# EAGLE schematic A10-OLinuXino_Rev_A (EAGLE 5.12)
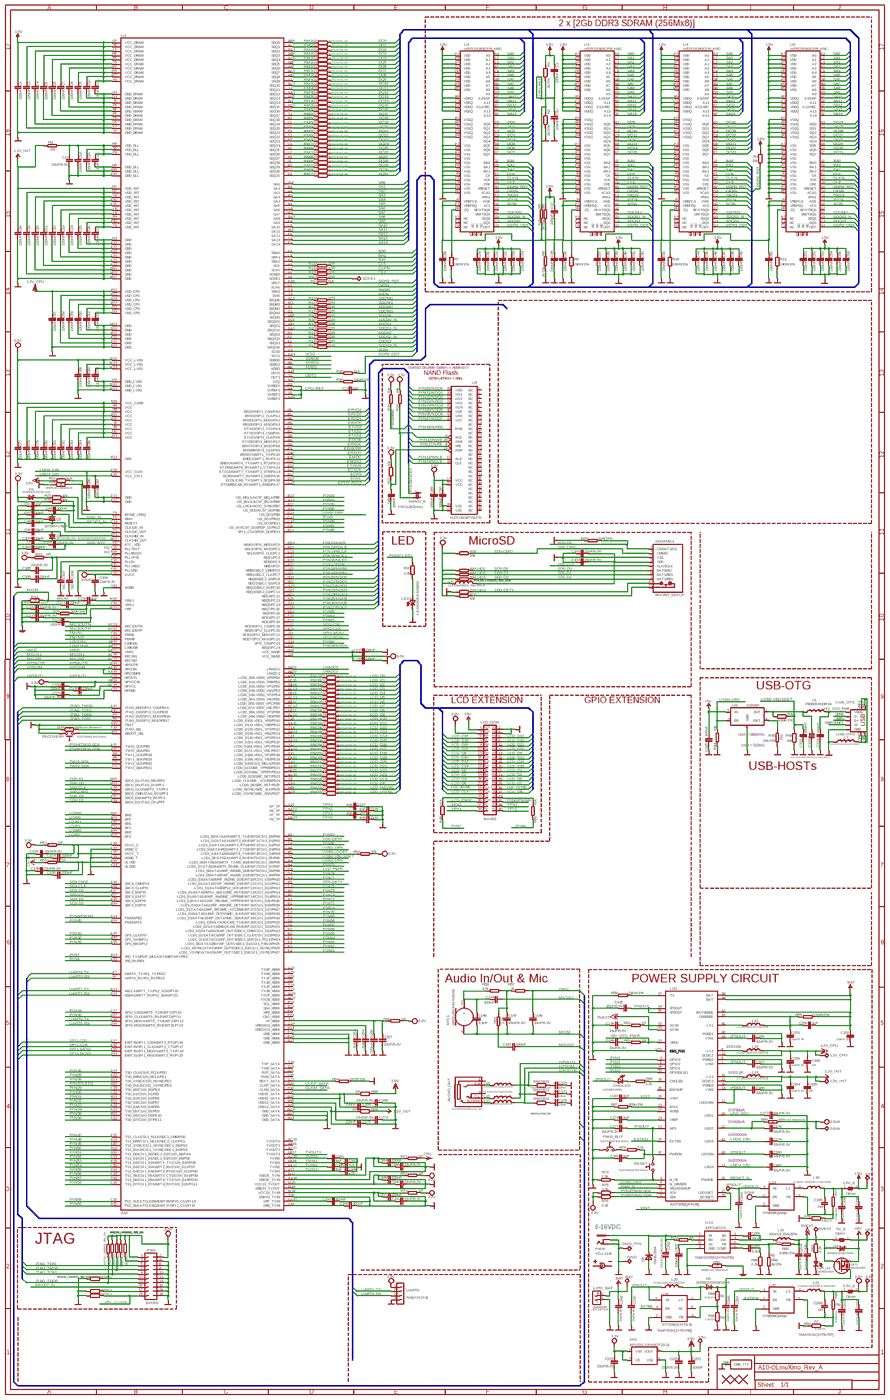
[diagram p0: schematic, sheet 1, overview]
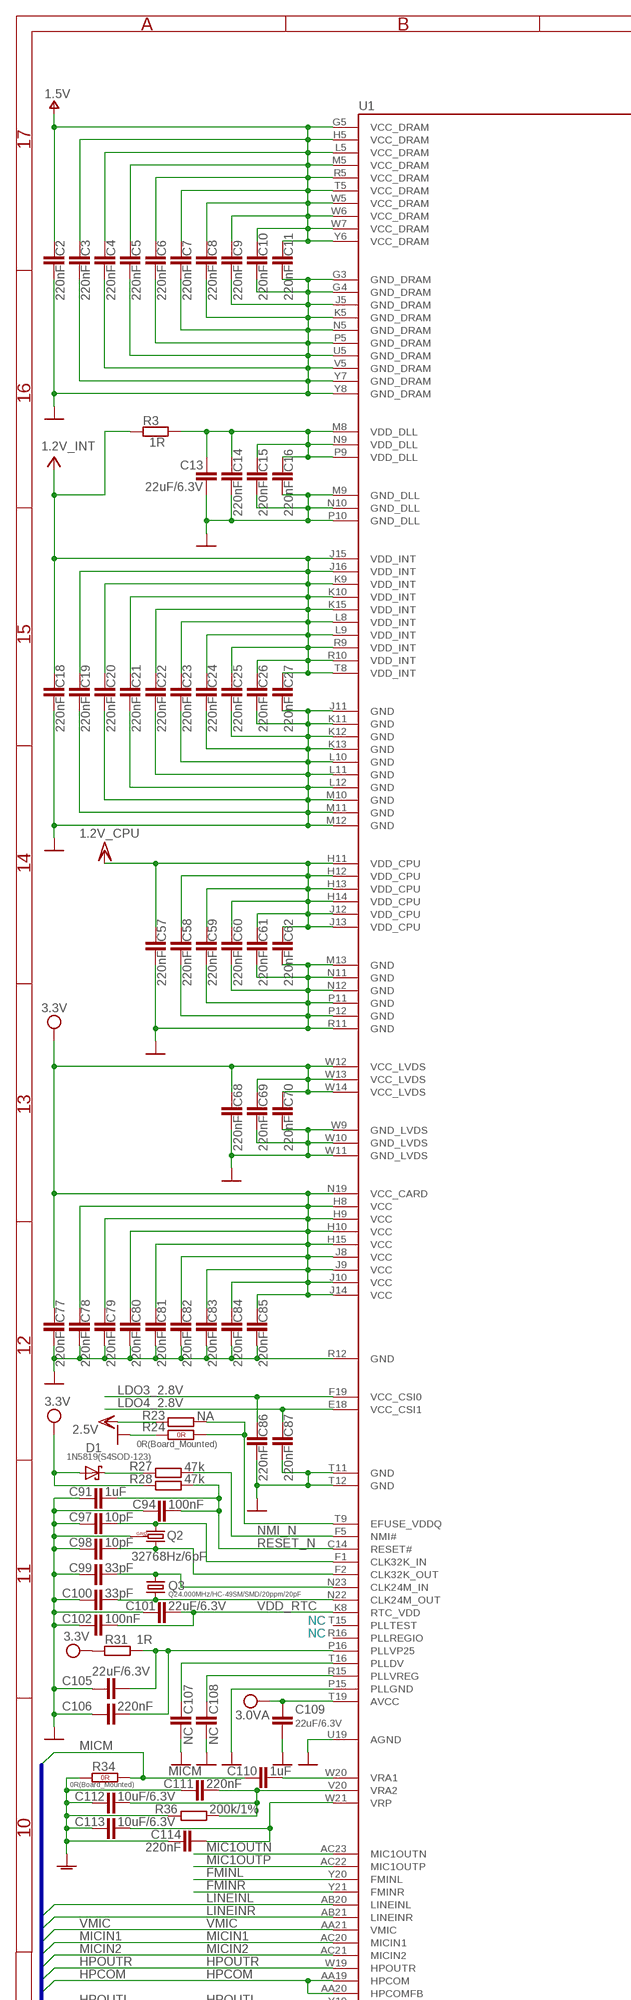
[diagram p1: schematic, sheet 1, part 1 of 4]
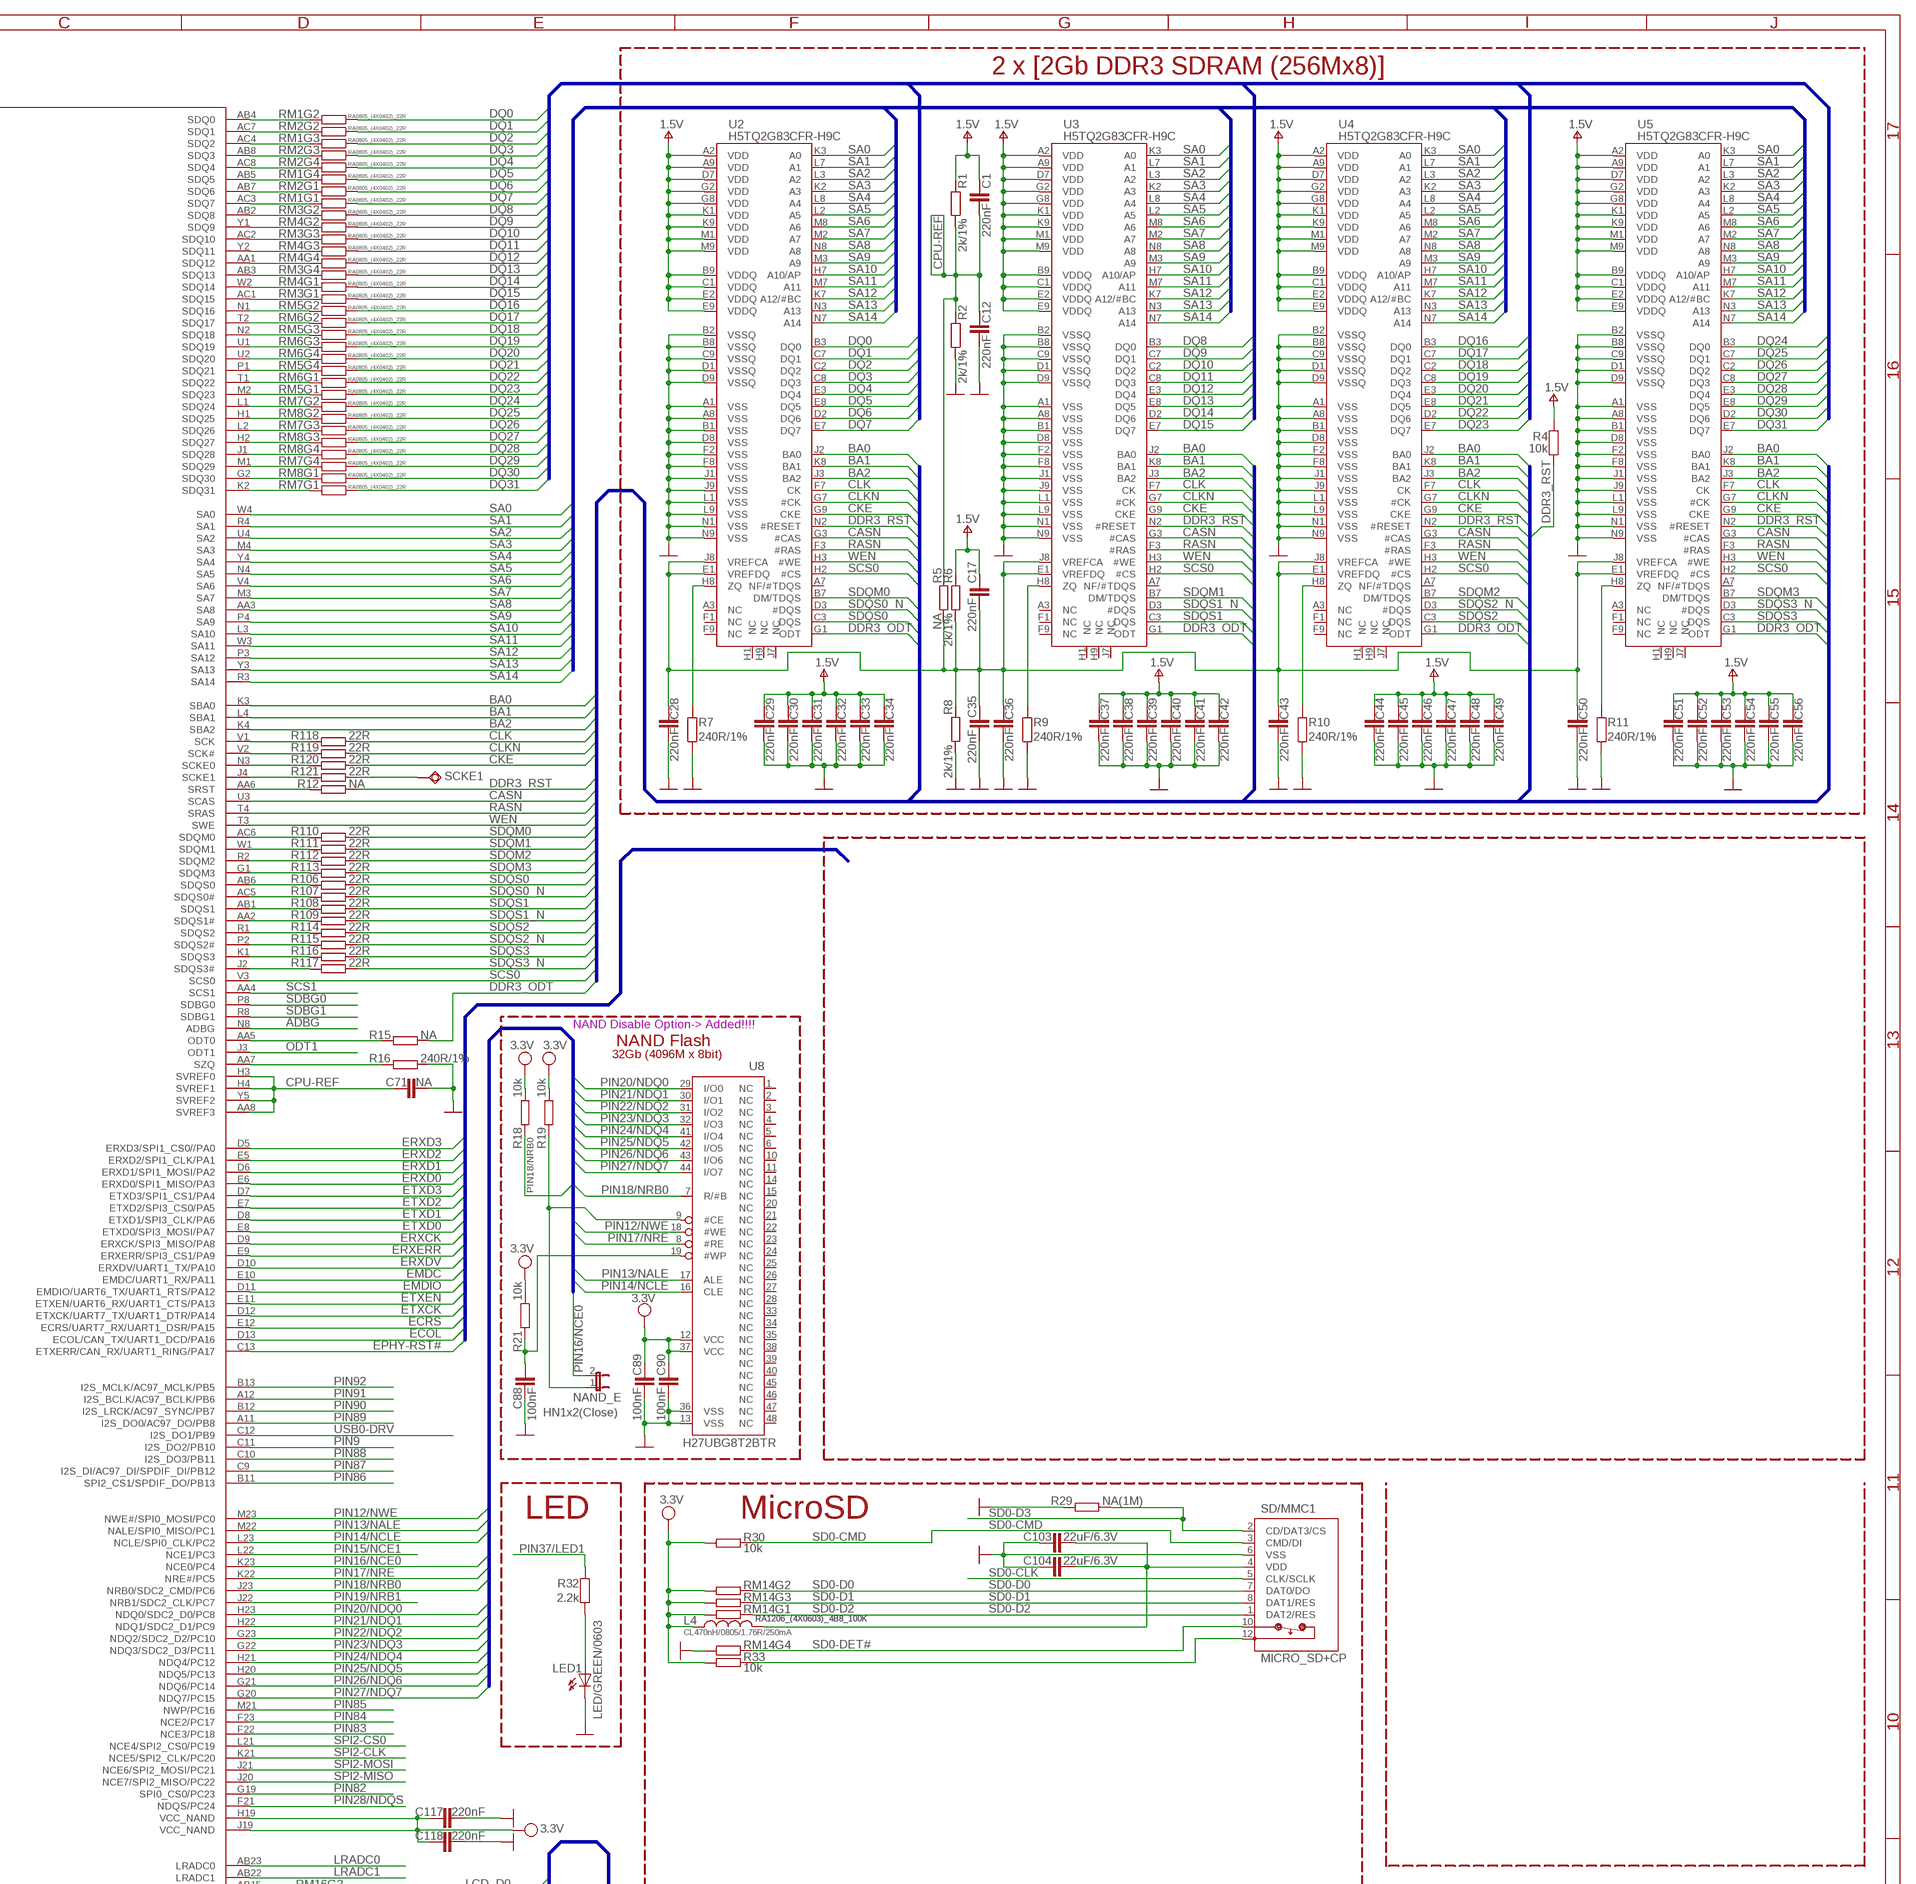
[diagram p2: schematic, sheet 1, part 2 of 4]
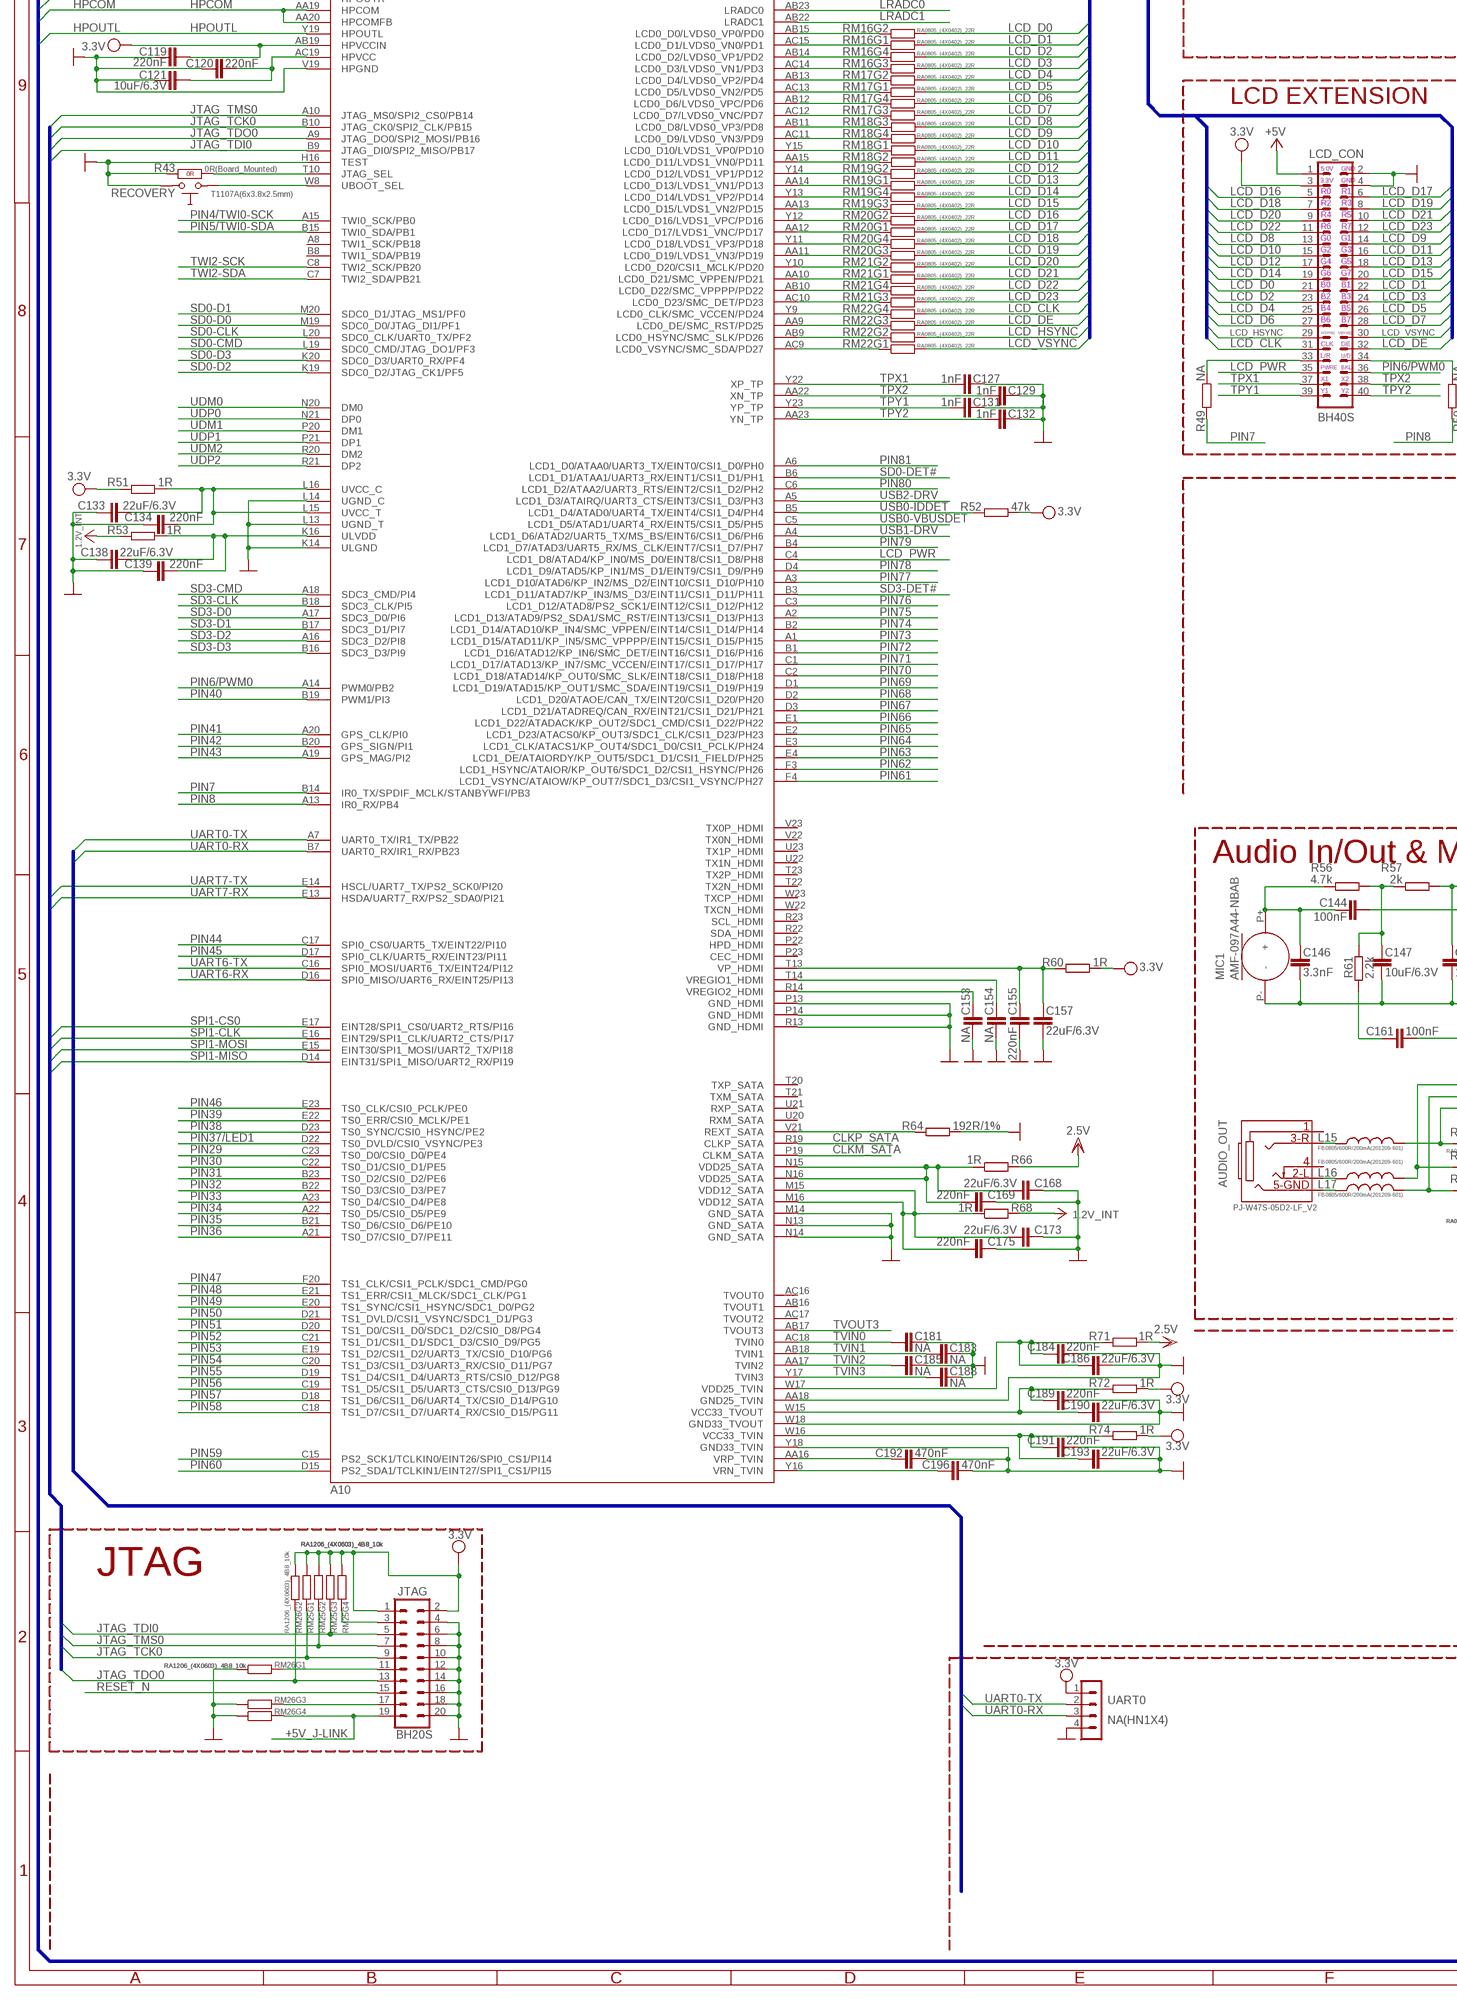
[diagram p3: schematic, sheet 1, part 3 of 4]
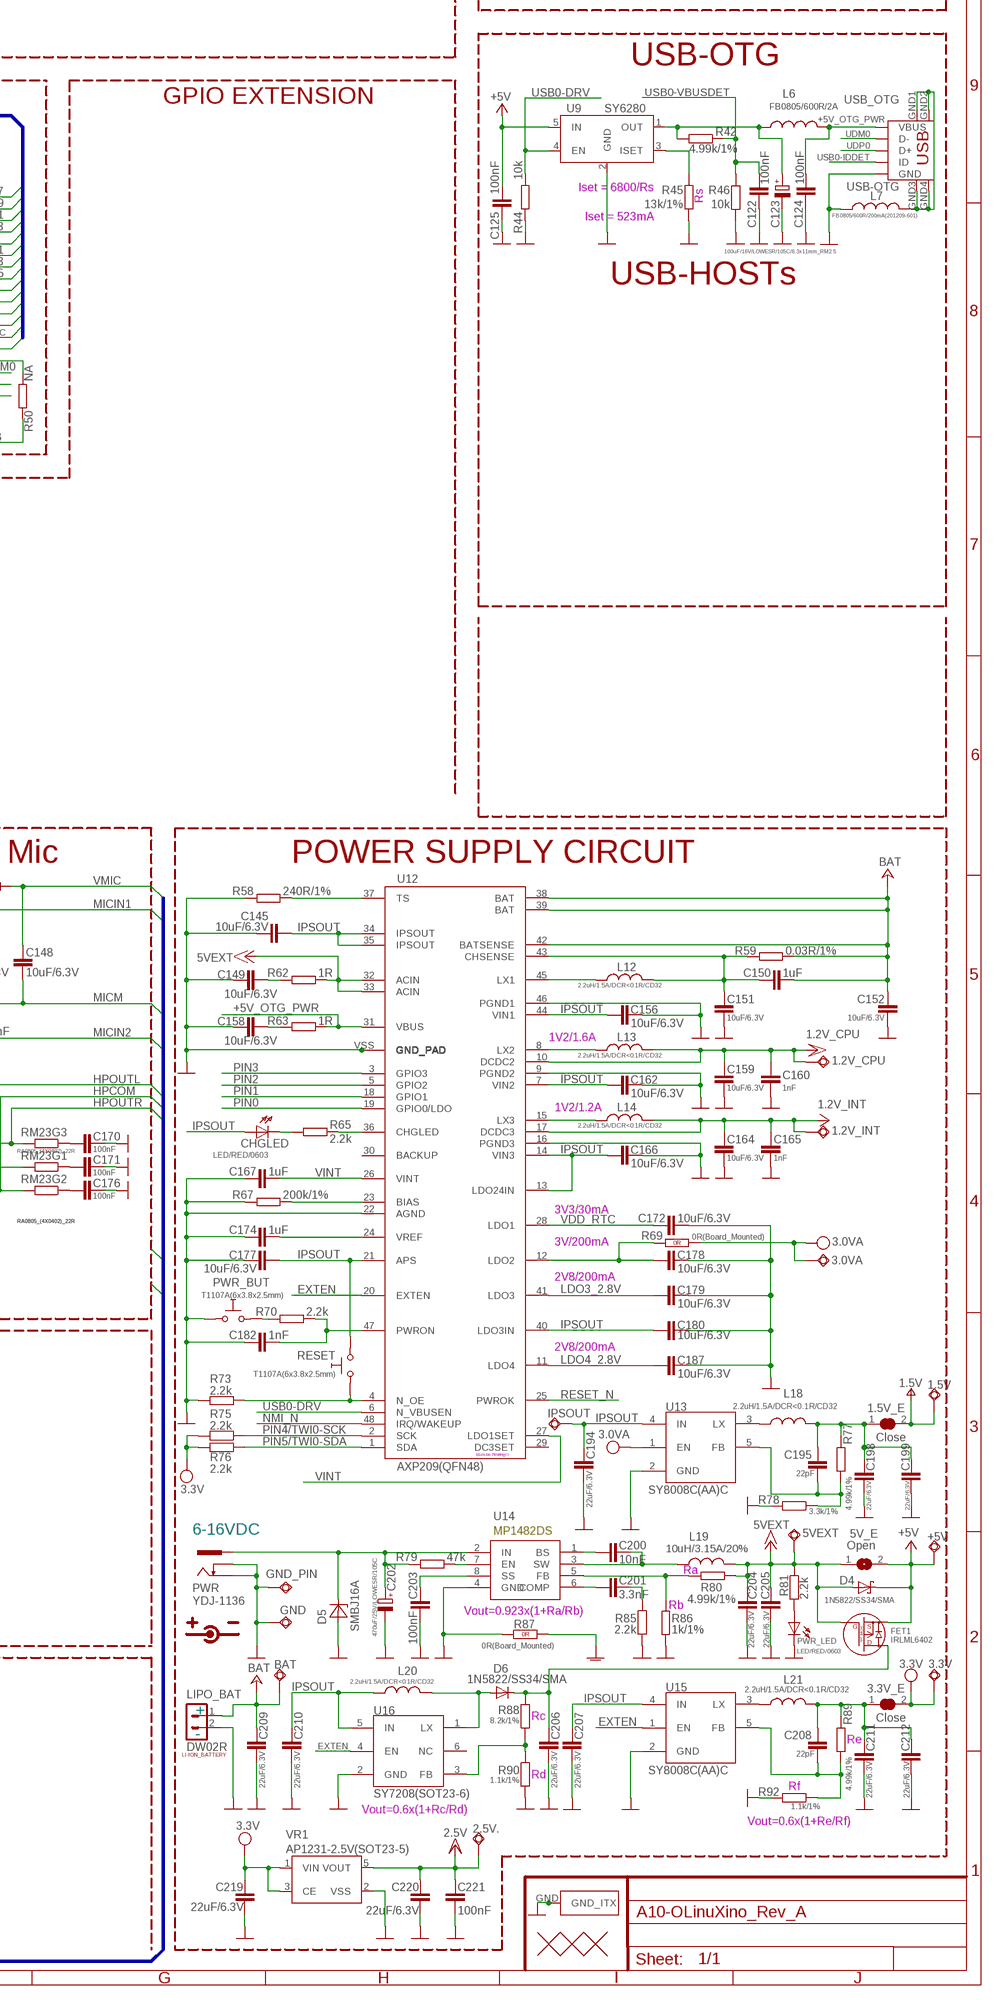
[diagram p4: schematic, sheet 1, part 4 of 4]

## Parts
1.2V_CPU  TESTPADTESTPAD_40-ROUND  [TESTPAD_40-ROUND]
1.2V_INT  TESTPADTESTPAD_40-ROUND  [TESTPAD_40-ROUND]
1.5V  TESTPADTESTPAD_40-ROUND  [TESTPAD_40-ROUND]
1.5V_E  Close  SJSJ_1_SMALLER_CLOSE  [SJ_1_SMALLER_CLOSE]
2.5V.  TESTPADTESTPAD_40-ROUND  [TESTPAD_40-ROUND]
3.0VA  TESTPADTESTPAD_40-ROUND  [TESTPAD_40-ROUND]
3.3V  TESTPADTESTPAD_40-ROUND  [TESTPAD_40-ROUND]
3.3V_E  Close  SJSJ_1_SMALLER_CLOSE  [SJ_1_SMALLER_CLOSE]
5V_E  Open  SJSJ_SMALLER  [SJ_1_SMALLER]
5VEXT  TESTPADTESTPAD_40-ROUND  [TESTPAD_40-ROUND]
+5V  TESTPADTESTPAD_40-ROUND  [TESTPAD_40-ROUND]
AUDIO_OUT  PJ-W47S-05D2-LF_V2  AUDIO_JACK_5PINPJ-W47S-05D2-LF_V2  [PJ-W47S-05D2-LF_5PIN_V2]
BAT  TESTPADTESTPAD_40-ROUND  [TESTPAD_40-ROUND]
C1  220nF  C-EUC0603_DWS  [C0603_DWS]
C2  220nF  C-EUC0603_DWS  [C0603_DWS]
C3  220nF  C-EUC0603_DWS  [C0603_DWS]
C4  220nF  C-EUC0603_DWS  [C0603_DWS]
C5  220nF  C-EUC0603_DWS  [C0603_DWS]
C6  220nF  C-EUC0603_DWS  [C0603_DWS]
C7  220nF  C-EUC0603_DWS  [C0603_DWS]
C8  220nF  C-EUC0603_DWS  [C0603_DWS]
C9  220nF  C-EUC0603_DWS  [C0603_DWS]
C10  220nF  C-EUC0603_DWS  [C0603_DWS]
C11  220nF  C-EUC0603_DWS  [C0603_DWS]
C12  220nF  C-EUC0603_DWS  [C0603_DWS]
C13  22uF/6.3V  C-EUC0603_DWS  [C0603_DWS]
C14  220nF  C-EUC0603_DWS  [C0603_DWS]
C15  220nF  C-EUC0603_DWS  [C0603_DWS]
C16  220nF  C-EUC0603_DWS  [C0603_DWS]
C17  220nF  C-EUC0603_DWS  [C0603_DWS]
C18  220nF  C-EUC0603_DWS  [C0603_DWS]
C19  220nF  C-EUC0603_DWS  [C0603_DWS]
C20  220nF  C-EUC0603_DWS  [C0603_DWS]
C21  220nF  C-EUC0603_DWS  [C0603_DWS]
C22  220nF  C-EUC0603_DWS  [C0603_DWS]
C23  220nF  C-EUC0603_DWS  [C0603_DWS]
C24  220nF  C-EUC0603_DWS  [C0603_DWS]
C25  220nF  C-EUC0603_DWS  [C0603_DWS]
C26  220nF  C-EUC0603_DWS  [C0603_DWS]
C27  220nF  C-EUC0603_DWS  [C0603_DWS]
C28  220nF  C-EUC0603_DWS  [C0603_DWS]
C29  220nF  C-EUC0603_DWS  [C0603_DWS]
C30  220nF  C-EUC0603_DWS  [C0603_DWS]
C31  220nF  C-EUC0603_DWS  [C0603_DWS]
C32  220nF  C-EUC0603_DWS  [C0603_DWS]
C33  220nF  C-EUC0603_DWS  [C0603_DWS]
C34  220nF  C-EUC0603_DWS  [C0603_DWS]
C35  220nF  C-EUC0603_DWS  [C0603_DWS]
C36  220nF  C-EUC0603_DWS  [C0603_DWS]
C37  220nF  C-EUC0603_DWS  [C0603_DWS]
C38  220nF  C-EUC0603_DWS  [C0603_DWS]
C39  220nF  C-EUC0603_DWS  [C0603_DWS]
C40  220nF  C-EUC0603_DWS  [C0603_DWS]
C41  220nF  C-EUC0603_DWS  [C0603_DWS]
C42  220nF  C-EUC0603_DWS  [C0603_DWS]
C43  220nF  C-EUC0603_DWS  [C0603_DWS]
C44  220nF  C-EUC0603_DWS  [C0603_DWS]
C45  220nF  C-EUC0603_DWS  [C0603_DWS]
C46  220nF  C-EUC0603_DWS  [C0603_DWS]
C47  220nF  C-EUC0603_DWS  [C0603_DWS]
C48  220nF  C-EUC0603_DWS  [C0603_DWS]
C49  220nF  C-EUC0603_DWS  [C0603_DWS]
C50  220nF  C-EUC0603_DWS  [C0603_DWS]
C51  220nF  C-EUC0603_DWS  [C0603_DWS]
C52  220nF  C-EUC0603_DWS  [C0603_DWS]
C53  220nF  C-EUC0603_DWS  [C0603_DWS]
C54  220nF  C-EUC0603_DWS  [C0603_DWS]
C55  220nF  C-EUC0603_DWS  [C0603_DWS]
C56  220nF  C-EUC0603_DWS  [C0603_DWS]
C57  220nF  C-EUC0603_DWS  [C0603_DWS]
C58  220nF  C-EUC0603_DWS  [C0603_DWS]
C59  220nF  C-EUC0603_DWS  [C0603_DWS]
C60  220nF  C-EUC0603_DWS  [C0603_DWS]
C61  220nF  C-EUC0603_DWS  [C0603_DWS]
C62  220nF  C-EUC0603_DWS  [C0603_DWS]
C68  220nF  C-EUC0603_DWS  [C0603_DWS]
C69  220nF  C-EUC0603_DWS  [C0603_DWS]
C70  220nF  C-EUC0603_DWS  [C0603_DWS]
C71  NA  C-EUC0603_DWS  [C0603_DWS]
C77  220nF  C-EUC0603_DWS  [C0603_DWS]
C78  220nF  C-EUC0603_DWS  [C0603_DWS]
C79  220nF  C-EUC0603_DWS  [C0603_DWS]
C80  220nF  C-EUC0603_DWS  [C0603_DWS]
C81  220nF  C-EUC0603_DWS  [C0603_DWS]
C82  220nF  C-EUC0603_DWS  [C0603_DWS]
C83  220nF  C-EUC0603_DWS  [C0603_DWS]
C84  220nF  C-EUC0603_DWS  [C0603_DWS]
C85  220nF  C-EUC0603_DWS  [C0603_DWS]
C86  220nF  C-EUC0603_DWS  [C0603_DWS]
C87  220nF  C-EUC0603_DWS  [C0603_DWS]
C88  100nF  C-EUC0603_DWS  [C0603_DWS]
C89  100nF  C-EUC0603_DWS  [C0603_DWS]
C90  100nF  C-EUC0603_DWS  [C0603_DWS]
C91  1uF  C-EUC0603_DWS  [C0603_DWS]
C94  100nF  C-EUC0603_DWS  [C0603_DWS]
C97  10pF  C-EUC0603_DWS  [C0603_DWS]
C98  10pF  C-EUC0603_DWS  [C0603_DWS]
C99  33pF  C-EUC0603_DWS  [C0603_DWS]
C100  33pF  C-EUC0603_DWS  [C0603_DWS]
C101  22uF/6.3V  C-EUC0603_DWS  [C0603_DWS]
C102  100nF  C-EUC0603_DWS  [C0603_DWS]
C103  22uF/6.3V  C-EUC0603_DWS  [C0603_DWS]
C104  22uF/6.3V  C-EUC0603_DWS  [C0603_DWS]
C105  22uF/6.3V  C-EUC0603_DWS  [C0603_DWS]
C106  220nF  C-EUC0603_DWS  [C0603_DWS]
C107  NC  C-EUC0603_DWS  [C0603_DWS]
C108  NC  C-EUC0603_DWS  [C0603_DWS]
C109  22uF/6.3V  C-EUC0603_DWS  [C0603_DWS]
C110  1uF  C-EUC0603_DWS  [C0603_DWS]
C111  220nF  C-EUC0603_DWS  [C0603_DWS]
C112  10uF/6.3V  C-EUC0603_DWS  [C0603_DWS]
C113  10uF/6.3V  C-EUC0603_DWS  [C0603_DWS]
C114  220nF  C-EUC0603_DWS  [C0603_DWS]
C117  220nF  C-EUC0603_DWS  [C0603_DWS]
C118  220nF  C-EUC0603_DWS  [C0603_DWS]
C119  220nF  C-EUC0603_DWS  [C0603_DWS]
C120  220nF  C-EUC0603_DWS  [C0603_DWS]
C121  10uF/6.3V  C-EUC0603_DWS  [C0603_DWS]
C122  100nF  C-EUC0603_DWS  [C0603_DWS]
C123  100uF/16V/LOWESR/105C/6.3x11mm_RM2.5  CPOL-EUE2.5-6.3  [E2,5-6,3]
C124  100nF  C-EUC0603_DWS  [C0603_DWS]
C125  100nF  C-EUC0603_DWS  [C0603_DWS]
C127  1nF  C-EUC0603_DWS  [C0603_DWS]
C129  1nF  C-EUC0603_DWS  [C0603_DWS]
C131  1nF  C-EUC0603_DWS  [C0603_DWS]
C132  1nF  C-EUC0603_DWS  [C0603_DWS]
C133  22uF/6.3V  C-EUC0603_DWS  [C0603_DWS]
C134  220nF  C-EUC0603_DWS  [C0603_DWS]
C138  22uF/6.3V  C-EUC0603_DWS  [C0603_DWS]
C139  220nF  C-EUC0603_DWS  [C0603_DWS]
C144  100nF  C-EUC0603_DWS  [C0603_DWS]
C145  10uF/6.3V  C-EUC0603_DWS  [C0603_DWS]
C146  3.3nF  C-EUC0603_DWS  [C0603_DWS]
C147  10uF/6.3V  C-EUC0603_DWS  [C0603_DWS]
C148  10uF/6.3V  C-EUC0603_DWS  [C0603_DWS]
C149  10uF/6.3V  C-EUC0603_DWS  [C0603_DWS]
C150  1uF  C-EUC0603_DWS  [C0603_DWS]
C151  10uF/6.3V  C-EUC0603_DWS  [C0603_DWS]
C152  10uF/6.3V  C-EUC0603_DWS  [C0603_DWS]
C153  NA  C-EUC0603_DWS  [C0603_DWS]
C154  NA  C-EUC0603_DWS  [C0603_DWS]
C155  220nF  C-EUC0603_DWS  [C0603_DWS]
C156  10uF/6.3V  C-EUC0603_DWS  [C0603_DWS]
C157  22uF/6.3V  C-EUC0603_DWS  [C0603_DWS]
C158  10uF/6.3V  C-EUC0603_DWS  [C0603_DWS]
C159  10uF/6.3V  C-EUC0603_DWS  [C0603_DWS]
C160  1nF  C-EUC0603_DWS  [C0603_DWS]
C161  100nF  C-EUC0603_DWS  [C0603_DWS]
C162  10uF/6.3V  C-EUC0603_DWS  [C0603_DWS]
C164  10uF/6.3V  C-EUC0603_DWS  [C0603_DWS]
C165  1nF  C-EUC0603_DWS  [C0603_DWS]
C166  10uF/6.3V  C-EUC0603_DWS  [C0603_DWS]
C167  1uF  C-EUC0603_DWS  [C0603_DWS]
C168  22uF/6.3V  C-EUC0603_DWS  [C0603_DWS]
C169  220nF  C-EUC0603_DWS  [C0603_DWS]
C170  100nF  C-EUC0603_DWS  [C0603_DWS]
C171  100nF  C-EUC0603_DWS  [C0603_DWS]
C172  10uF/6.3V  C-EUC0603_DWS  [C0603_DWS]
C173  22uF/6.3V  C-EUC0603_DWS  [C0603_DWS]
C174  1uF  C-EUC0603_DWS  [C0603_DWS]
C175  220nF  C-EUC0603_DWS  [C0603_DWS]
C176  100nF  C-EUC0603_DWS  [C0603_DWS]
C177  10uF/6.3V  C-EUC0603_DWS  [C0603_DWS]
C178  10uF/6.3V  C-EUC0603_DWS  [C0603_DWS]
C179  10uF/6.3V  C-EUC0603_DWS  [C0603_DWS]
C180  10uF/6.3V  C-EUC0603_DWS  [C0603_DWS]
C181  NA  C-EUC0603_DWS  [C0603_DWS]
C182  1nF  C-EUC0603_DWS  [C0603_DWS]
C183  NA  C-EUC0603_DWS  [C0603_DWS]
C184  220nF  C-EUC0603_DWS  [C0603_DWS]
C185  NA  C-EUC0603_DWS  [C0603_DWS]
C186  22uF/6.3V  C-EUC0603_DWS  [C0603_DWS]
C187  10uF/6.3V  C-EUC0603_DWS  [C0603_DWS]
C188  NA  C-EUC0603_DWS  [C0603_DWS]
C189  220nF  C-EUC0603_DWS  [C0603_DWS]
C190  22uF/6.3V  C-EUC0603_DWS  [C0603_DWS]
C191  220nF  C-EUC0603_DWS  [C0603_DWS]
C192  470nF  C-EUC0603_DWS  [C0603_DWS]
C193  22uF/6.3V  C-EUC0603_DWS  [C0603_DWS]
C194  22uF/6.3V  C-EUC0603_DWS  [C0603_DWS]
C195  22pF  C-EUC0603_DWS  [C0603_DWS]
C196  470nF  C-EUC0603_DWS  [C0603_DWS]
C198  22uF/6.3V  C-EUC0603_DWS  [C0603_DWS]
C199  22uF/6.3V  C-EUC0603_DWS  [C0603_DWS]
C200  10nF  C-EUC0603_DWS  [C0603_DWS]
C201  3.3nF  C-EUC0603_DWS  [C0603_DWS]
C202  470uF/25V/LOWESR/105C  CPOL-EUE5-10.5  [E5-10,5]
C203  100nF  C-EUC0603_DWS  [C0603_DWS]
C204  22uF/6.3V  C-EUC0603_DWS  [C0603_DWS]
C205  22uF/6.3V  C-EUC0603_DWS  [C0603_DWS]
C206  22uF/6.3V  C-EUC0603_DWS  [C0603_DWS]
C207  22uF/6.3V  C-EUC0603_DWS  [C0603_DWS]
C208  22pF  C-EUC0603_DWS  [C0603_DWS]
C209  22uF/6.3V  C-EUC0603_DWS  [C0603_DWS]
C210  22uF/6.3V  C-EUC0603_DWS  [C0603_DWS]
C211  22uF/6.3V  C-EUC0603_DWS  [C0603_DWS]
C212  22uF/6.3V  C-EUC0603_DWS  [C0603_DWS]
C219  22uF/6.3V  C-EUC0603_DWS  [C0603_DWS]
C220  22uF/6.3V  C-EUC0603_DWS  [C0603_DWS]
C221  100nF  C-EUC0603_DWS  [C0603_DWS]
CHGLED  LED/RED/0603  LED0603DWS  [LED-0603]
D1  1N5819(S4SOD-123)  SCHOTKKY7.62SS-1N5819(S4SOD-123)  [SOD-123]
D4  1N5822/SS34/SMA  SCHOTKKY7.62SS2  [MLL-41]
D5  SMBJ16A  [DO214AA]
D6  1N5822/SS34/SMA  D-MLL-41  [MELF-MLL41]
FET1  IRLML6402  P-MOS+DIODIRLML6402  [SOT23]
GND  TESTPADTESTPAD_40-ROUND  [TESTPAD_40-ROUND]
GND_PIN  TESTPAD3  [TEST_PAD40/70/SQUARE]
IPSOUT  TESTPADTESTPAD_40-ROUND  [TESTPAD_40-ROUND]
JTAG  BH20S  ML20  [ML20-MALE]
L4  CL470nH/0805/1.76R/250mA  L-USL0805_5MIL_DWS  [L0805_5MIL_DWS]
L6  FB0805/600R/2A  L-USL0805_5MIL_DWS  [L0805_5MIL_DWS]
L7  FB0805/600R/200mA(201209-601)  L-USL0805_5MIL_DWS  [L0805_5MIL_DWS]
L12  2.2uH/1.5A/DCR<0.1R/CD32  L-CD32  [CD32]
L13  2.2uH/1.5A/DCR<0.1R/CD32  L-CD32  [CD32]
L14  2.2uH/1.5A/DCR<0.1R/CD32  L-CD32  [CD32]
L15  FB0805/600R/200mA(201209-601)  L-USL0805_5MIL_DWS  [L0805_5MIL_DWS]
L16  FB0805/600R/200mA(201209-601)  L-USL0805_5MIL_DWS  [L0805_5MIL_DWS]
L17  FB0805/600R/200mA(201209-601)  L-USL0805_5MIL_DWS  [L0805_5MIL_DWS]
L18  2.2uH/1.5A/DCR<0.1R/CD32  L-CD32  [CD32]
L19  10uH/3.15A/20%  LLQH88PN100M38  [8X8MM_3131]
L20  2.2uH/1.5A/DCR<0.1R/CD32  L-CD32  [CD32]
L21  2.2uH/1.5A/DCR<0.1R/CD32  L-CD32  [CD32]
LCD_CON  BH40S  ML40  [ML40]
LED1  LED/GREEN/0603  LED0603DWS  [LED-0603]
LIPO_BAT  DW02R  CON2DW02R  [DW02R]
MIC1  AMF-097A44-NBAB  MICR  [MIC]
NAND_E  HN1x2(Close)  JP1E  [JP1]
PWR  YDJ-1136  PWR-JAKPWR_JACK_UNI_MILLING  [PWR_JACK_UNI_MILLING]
PWR_BUT  T1107A(6x3.8x2.5mm)  SW-TAKT6  [SW-TAKT_6X3.5_SMD]
PWR_LED  LED/RED/0603  LED0603DWS  [LED-0603]
Q2  32768Hz/6pF  Q_GND1  [TC26H_3_REPAIR_SMD]
Q3  Q24.000MHz/HC-49SM/SMD/20ppm/20pF  HC49/S1  [HC49/SMD2_THIN]
R1  2k/1%  R-EU_R0603_5MIL_DWS  [R0603_5MIL_DWS]
R2  2k/1%  R-EU_R0603_5MIL_DWS  [R0603_5MIL_DWS]
R3  1R  R-EU_R0603_5MIL_DWS  [R0603_5MIL_DWS]
R4  10k  R-EU_R0603_5MIL_DWS  [R0603_5MIL_DWS]
R5  NA  R-EU_R0603_5MIL_DWS  [R0603_5MIL_DWS]
R6  2k/1%  R-EU_R0603_5MIL_DWS  [R0603_5MIL_DWS]
R7  240R/1%  R-EU_R0603_5MIL_DWS  [R0603_5MIL_DWS]
R8  2k/1%  R-EU_R0603_5MIL_DWS  [R0603_5MIL_DWS]
R9  240R/1%  R-EU_R0603_5MIL_DWS  [R0603_5MIL_DWS]
R10  240R/1%  R-EU_R0603_5MIL_DWS  [R0603_5MIL_DWS]
R11  240R/1%  R-EU_R0603_5MIL_DWS  [R0603_5MIL_DWS]
R12  NA  R-EU_R0603_5MIL_DWS  [R0603_5MIL_DWS]
R15  NA  R-EU_R0603_5MIL_DWS  [R0603_5MIL_DWS]
R16  240R/1%  R-EU_R0603_5MIL_DWS  [R0603_5MIL_DWS]
R18  10k  R-EU_R0603_5MIL_DWS  [R0603_5MIL_DWS]
R19  10k  R-EU_R0603_5MIL_DWS  [R0603_5MIL_DWS]
R21  10k  R-EU_R0603_5MIL_DWS  [R0603_5MIL_DWS]
R23  NA  R-EU_R0603_5MIL_DWS  [R0603_5MIL_DWS]
R24  0R(Board_Mounted)  R_0R0R(NA)  [0603_0R]
R27  47k  R-EU_R0603_5MIL_DWS  [R0603_5MIL_DWS]
R28  47k  R-EU_R0603_5MIL_DWS  [R0603_5MIL_DWS]
R29  NA(1M)  R-EU_R0603_5MIL_DWS  [R0603_5MIL_DWS]
R30  10k  R-EU_R0603_5MIL_DWS  [R0603_5MIL_DWS]
R31  1R  R-EU_R0603_5MIL_DWS  [R0603_5MIL_DWS]
R32  2.2k  R-EU_R0603_5MIL_DWS  [R0603_5MIL_DWS]
R33  10k  R-EU_R0603_5MIL_DWS  [R0603_5MIL_DWS]
R34  0R(Board_Mounted)  R_0R0R(NA)  [0603_0R]
R36  200k/1%  R-EU_R0603_5MIL_DWS  [R0603_5MIL_DWS]
R42  4.99k/1%  R-EU_R0603_5MIL_DWS  [R0603_5MIL_DWS]
R43  0R(Board_Mounted)  R_0R0R(NA)  [0603_0R]
R44  10k  R-EU_R0603_5MIL_DWS  [R0603_5MIL_DWS]
R45  13k/1%  R-EU_R0603_5MIL_DWS  [R0603_5MIL_DWS]
R46  10k  R-EU_R0603_5MIL_DWS  [R0603_5MIL_DWS]
R49  NA  R-EU_R0603_5MIL_DWS  [R0603_5MIL_DWS]
R50  NA  R-EU_R0603_5MIL_DWS  [R0603_5MIL_DWS]
R51  1R  R-EU_R0603_5MIL_DWS  [R0603_5MIL_DWS]
R52  47k  R-EU_R0603_5MIL_DWS  [R0603_5MIL_DWS]
R53  1R  R-EU_R0603_5MIL_DWS  [R0603_5MIL_DWS]
R56  4.7k  R-EU_R0603_5MIL_DWS  [R0603_5MIL_DWS]
R57  2k  R-EU_R0603_5MIL_DWS  [R0603_5MIL_DWS]
R58  240R/1%  R-EU_R0603_5MIL_DWS  [R0603_5MIL_DWS]
R59  0.03R/1%  R-EU_R1206_5MIL_WS  [R1206_5MIL_WS]
R60  1R  R-EU_R0603_5MIL_DWS  [R0603_5MIL_DWS]
R61  2.2k  R-EU_R0603_5MIL_DWS  [R0603_5MIL_DWS]
R62  1R  R-EU_R0603_5MIL_DWS  [R0603_5MIL_DWS]
R63  1R  R-EU_R0603_5MIL_DWS  [R0603_5MIL_DWS]
R64  192R/1%  R-EU_R0603_5MIL_DWS  [R0603_5MIL_DWS]
R65  2.2k  R-EU_R0603_5MIL_DWS  [R0603_5MIL_DWS]
R66  1R  R-EU_R0603_5MIL_DWS  [R0603_5MIL_DWS]
R67  200k/1%  R-EU_R0603_5MIL_DWS  [R0603_5MIL_DWS]
R68  1R  R-EU_R0603_5MIL_DWS  [R0603_5MIL_DWS]
R69  0R(Board_Mounted)  R_0R0R(NA)  [0603_0R]
R70  2.2k  R-EU_R0603_5MIL_DWS  [R0603_5MIL_DWS]
R71  1R  R-EU_R0603_5MIL_DWS  [R0603_5MIL_DWS]
R72  1R  R-EU_R0603_5MIL_DWS  [R0603_5MIL_DWS]
R73  2.2k  R-EU_R0603_5MIL_DWS  [R0603_5MIL_DWS]
R74  1R  R-EU_R0603_5MIL_DWS  [R0603_5MIL_DWS]
R75  2.2k  R-EU_R0603_5MIL_DWS  [R0603_5MIL_DWS]
R76  2.2k  R-EU_R0603_5MIL_DWS  [R0603_5MIL_DWS]
R77  4.99k/1%  R-EU_R0603_5MIL_DWS  [R0603_5MIL_DWS]
R78  3.3k/1%  R-EU_R0603_5MIL_DWS  [R0603_5MIL_DWS]
R79  47k  R-EU_R0603_5MIL_DWS  [R0603_5MIL_DWS]
R80  4.99k/1%  R-EU_R0603_5MIL_DWS  [R0603_5MIL_DWS]
R81  2.2k  R-EU_R0603_5MIL_DWS  [R0603_5MIL_DWS]
R85  2.2k  R-EU_R0603_5MIL_DWS  [R0603_5MIL_DWS]
R86  1k/1%  R-EU_R0603_5MIL_DWS  [R0603_5MIL_DWS]
R87  0R(Board_Mounted)  R_0R0R(NA)  [0603_0R]
R88  8.2k/1%  R-EU_R0603_5MIL_DWS  [R0603_5MIL_DWS]
R89  4.99k/1%  R-EU_R0603_5MIL_DWS  [R0603_5MIL_DWS]
R90  1.1k/1%  R-EU_R0603_5MIL_DWS  [R0603_5MIL_DWS]
R92  1.1k/1%  R-EU_R0603_5MIL_DWS  [R0603_5MIL_DWS]
R106  22R  R-EU_R0603_5MIL_DWS  [R0603_5MIL_DWS]
R107  22R  R-EU_R0603_5MIL_DWS  [R0603_5MIL_DWS]
R108  22R  R-EU_R0603_5MIL_DWS  [R0603_5MIL_DWS]
R109  22R  R-EU_R0603_5MIL_DWS  [R0603_5MIL_DWS]
R110  22R  R-EU_R0603_5MIL_DWS  [R0603_5MIL_DWS]
R111  22R  R-EU_R0603_5MIL_DWS  [R0603_5MIL_DWS]
R112  22R  R-EU_R0603_5MIL_DWS  [R0603_5MIL_DWS]
R113  22R  R-EU_R0603_5MIL_DWS  [R0603_5MIL_DWS]
R114  22R  R-EU_R0603_5MIL_DWS  [R0603_5MIL_DWS]
R115  22R  R-EU_R0603_5MIL_DWS  [R0603_5MIL_DWS]
R116  22R  R-EU_R0603_5MIL_DWS  [R0603_5MIL_DWS]
R117  22R  R-EU_R0603_5MIL_DWS  [R0603_5MIL_DWS]
R118  22R  R-EU_R0603_5MIL_DWS  [R0603_5MIL_DWS]
R119  22R  R-EU_R0603_5MIL_DWS  [R0603_5MIL_DWS]
R120  22R  R-EU_R0603_5MIL_DWS  [R0603_5MIL_DWS]
R121  22R  R-EU_R0603_5MIL_DWS  [R0603_5MIL_DWS]
RECOVERY  T1107A(6x3.8x2.5mm)  SW-TAKT6  [SW-TAKT_6X3.5_SMD]
RESET  T1107A(6x3.8x2.5mm)  SW-TAKT6  [SW-TAKT_6X3.5_SMD]
RM1  RA0805_(4X0402)_22R  R_MATRIX_4E_25X625  [R_MATRIX_4_0402_25X625]
RM2  RA0805_(4X0402)_22R  R_MATRIX_4E_25X625  [R_MATRIX_4_0402_25X625]
RM3  RA0805_(4X0402)_22R  R_MATRIX_4E_25X625  [R_MATRIX_4_0402_25X625]
RM4  RA0805_(4X0402)_22R  R_MATRIX_4E_25X625  [R_MATRIX_4_0402_25X625]
RM5  RA0805_(4X0402)_22R  R_MATRIX_4E_25X625  [R_MATRIX_4_0402_25X625]
RM6  RA0805_(4X0402)_22R  R_MATRIX_4E_25X625  [R_MATRIX_4_0402_25X625]
RM7  RA0805_(4X0402)_22R  R_MATRIX_4E_25X625  [R_MATRIX_4_0402_25X625]
RM8  RA0805_(4X0402)_22R  R_MATRIX_4E_25X625  [R_MATRIX_4_0402_25X625]
RM14  RA1206_(4X0603)_4B8_100K  R_MATRIX_4E  [R_MATRIX_4]
RM16  RA0805_(4X0402)_22R  R_MATRIX_4E_25X625  [R_MATRIX_4_0402_25X625]
RM17  RA0805_(4X0402)_22R  R_MATRIX_4E_25X625  [R_MATRIX_4_0402_25X625]
RM18  RA0805_(4X0402)_22R  R_MATRIX_4E_25X625  [R_MATRIX_4_0402_25X625]
RM19  RA0805_(4X0402)_22R  R_MATRIX_4E_25X625  [R_MATRIX_4_0402_25X625]
RM20  RA0805_(4X0402)_22R  R_MATRIX_4E_25X625  [R_MATRIX_4_0402_25X625]
RM21  RA0805_(4X0402)_22R  R_MATRIX_4E_25X625  [R_MATRIX_4_0402_25X625]
RM22  RA0805_(4X0402)_22R  R_MATRIX_4E_25X625  [R_MATRIX_4_0402_25X625]
RM23  RA0805_(4X0402)_22R  R_MATRIX_4E_25X625  [R_MATRIX_4_0402_25X625]
RM25  RA1206_(4X0603)_4B8_10k  R_MATRIX_4E  [R_MATRIX_4]
RM26  RA1206_(4X0603)_4B8_10k  R_MATRIX_4E  [R_MATRIX_4]
SCKE1  TESTPAD3  [TEST_PAD40/70/SQUARE]
SD/MMC1  MICRO_SD+CP  MICRO_SD/MMC_CPMICRO  [TFR-MEM-CON]
U1  A10  [TFBGA441]
U2  H5TQ2G83CFR-H9C  [FBGA78]
U3  H5TQ2G83CFR-H9C  [FBGA78]
U4  H5TQ2G83CFR-H9C  [FBGA78]
U5  H5TQ2G83CFR-H9C  [FBGA78]
U8  H27UBG8T2BTR  H27UBG8T2A  [TSOP48]
U9  SY6280  [SOT23-5]
U12  AXP209(QFN48)  AXP209  [QFN48]
U13  SY8008C(AA)C  SY8008  [SOT23-5]
U14  MP1482DS  MP1482  [SOIC8]
U15  SY8008C(AA)C  SY8008  [SOT23-5]
U16  SY7208(SOT23-6)  SY7208  [SOT23-6]
U19  FIDUCIAL1X2  [FIDUCIAL-1X2]
U20  FIDUCIAL1X2  [FIDUCIAL-1X2]
U21  FIDUCIAL1X2  [FIDUCIAL-1X2]
U$1  NANO_ITX_  [NANO-ITX_140X140]
UART0  NA(HN1X4)  CON4HN1X4  [HN1X4]
USB_OTG  USB-OTG  MINI_USB9  [USB_MINI_9PIN]
VR1  AP1231-2.5V(SOT23-5)  AP1231-33  [SOT-23-5]

## Nets
+5V: 5V_E.2 +5V.1(PP) C125.1 D4.K(C) FET1.2(S) LCD_CON.1 U9.5(IN)
+5V_J-LINK: JTAG.19 RM26.4.2
+5V_OTG_PWR: C124.1 L6.1 R63.2 U12.31(VBUS) USB_OTG.VBUS
+15V: 5V_E.1 5VEXT.1(PP) C204.1 C205.1 D4.A FET1.1(G) L19.2 R62.2 R80.2 R81.1 U12.32(ACIN) U12.33(ACIN) ; supply symbol labelled 5VEXT
+24V: BAT.1(PP) C150.2 C152.1 C209.2 LIPO_BAT.1 R59.2 U12.38(BAT) U12.39(BAT) U12.42(BATSENSE) ; supply symbol labelled BAT
ADBG: U1.N8(ADBG)
BA0: U1.K3(SBA0) U2.J2(BA0) U3.J2(BA0) U4.J2(BA0) U5.J2(BA0)
BA1: U1.L4(SBA1) U2.K8(BA1) U3.K8(BA1) U4.K8(BA1) U5.K8(BA1)
BA2: U1.K4(SBA2) U2.J3(BA2) U3.J3(BA2) U4.J3(BA2) U5.J3(BA2)
CASN: U1.U3(SCAS) U2.G3(#CAS) U3.G3(#CAS) U4.G3(#CAS) U5.G3(#CAS)
CKE: R120.1 U2.G9(CKE) U3.G9(CKE) U4.G9(CKE) U5.G9(CKE)
CLK: R118.1 U2.F7(CK) U3.F7(CK) U4.F7(CK) U5.F7(CK)
CLKM_SATA: U1.P19(CLKM_SATA)
CLKN: R119.1 U2.G7(#CK) U3.G7(#CK) U4.G7(#CK) U5.G7(#CK)
CLKP_SATA: U1.R19(CLKP_SATA)
CPU-REF: C1.2 C12.2 C71.2 R1.1 R2.2 R5.2 U1.AA8(SVREF3) U1.H3(SVREF0) U1.H4(SVREF1) U1.Y5(SVREF2)
DDR3_ODT: R15.1 U2.G1(ODT) U3.G1(ODT) U4.G1(ODT) U5.G1(ODT)
DDR3_RST: R4.1 R12.1 U2.N2(#RESET) U3.N2(#RESET) U4.N2(#RESET) U5.N2(#RESET)
DDR3_SDQM0: R110.2 U1.AC6(SDQM0)
DDR3_SDQM1: R111.2 U1.W1(SDQM1)
DDR3_SDQM2: R112.2 U1.R2(SDQM2)
DDR3_SDQM3: R113.2 U1.G1(SDQM3)
DDR3_SDQS0: R106.2 U1.AB6(SDQS0)
DDR3_SDQS0#: R107.2 U1.AC5(SDQS0#)
DDR3_SDQS1: R108.2 U1.AB1(SDQS1)
DDR3_SDQS1#: R109.2 U1.AA2(SDQS1#)
DDR3_SDQS2: R114.2 U1.R1(SDQS2)
DDR3_SDQS2#: R115.2 U1.P2(SDQS2#)
DDR3_SDQS3: R116.2 U1.K1(SDQS3)
DDR3_SDQS3#: R117.2 U1.J2(SDQS3#)
DQ0: RM1.2.1 U2.B3(DQ0)
DQ1: RM2.2.1 U2.C7(DQ1)
DQ2: RM1.3.1 U2.C2(DQ2)
DQ3: RM2.3.1 U2.C8(DQ3)
DQ4: RM2.4.1 U2.E3(DQ4)
DQ5: RM1.4.1 U2.E8(DQ5)
DQ6: RM2.1.1 U2.D2(DQ6)
DQ7: RM1.1.1 U2.E7(DQ7)
DQ8: RM3.2.1 U3.B3(DQ0)
DQ9: RM4.2.1 U3.C7(DQ1)
DQ10: RM3.3.1 U3.C2(DQ2)
DQ11: RM4.3.1 U3.C8(DQ3)
DQ12: RM4.4.1 U3.E3(DQ4)
DQ13: RM3.4.1 U3.E8(DQ5)
DQ14: RM4.1.1 U3.D2(DQ6)
DQ15: RM3.1.1 U3.E7(DQ7)
DQ16: RM5.2.1 U4.B3(DQ0)
DQ17: RM6.2.1 U4.C7(DQ1)
DQ18: RM5.3.1 U4.C2(DQ2)
DQ19: RM6.3.1 U4.C8(DQ3)
DQ20: RM6.4.1 U4.E3(DQ4)
DQ21: RM5.4.1 U4.E8(DQ5)
DQ22: RM6.1.1 U4.D2(DQ6)
DQ23: RM5.1.1 U4.E7(DQ7)
DQ24: RM7.2.1 U5.B3(DQ0)
DQ25: RM8.2.1 U5.C7(DQ1)
DQ26: RM7.3.1 U5.C2(DQ2)
DQ27: RM8.3.1 U5.C8(DQ3)
DQ28: RM8.4.1 U5.E3(DQ4)
DQ29: RM7.4.1 U5.E8(DQ5)
DQ30: RM8.1.1 U5.D2(DQ6)
DQ31: RM7.1.1 U5.E7(DQ7)
DRAM-REF: C17.2 C28.2 C35.2 C36.2 C43.2 C50.2 R5.1 R6.1 R8.2 U2.E1(VREFDQ) U2.J8(VREFCA) U3.E1(VREFDQ) U3.J8(VREFCA) U4.E1(VREFDQ) U4.J8(VREFCA) U5.E1(VREFDQ) U5.J8(VREFCA)
ECOL: U1.D13(ECOL/CAN_TX/UART1_DCD/PA16)
ECRS: U1.E12(ECRS/UART7_RX/UART1_DSR/PA15)
EMDC: U1.E10(EMDC/UART1_RX/PA11)
EMDIO: U1.D11(EMDIO/UART6_TX/UART1_RTS/PA12)
EPHY-RST#: U1.C13(ETXERR/CAN_RX/UART1_RING/PA17)
ERXCK: U1.D9(ERXCK/SPI3_MISO/PA8)
ERXD0: U1.E6(ERXD0/SPI1_MISO/PA3)
ERXD1: U1.D6(ERXD1/SPI1_MOSI/PA2)
ERXD2: U1.E5(ERXD2/SPI1_CLK/PA1)
ERXD3: U1.D5(ERXD3/SPI1_CS0//PA0)
ERXDV: U1.D10(ERXDV/UART1_TX/PA10)
ERXERR: U1.E9(ERXERR/SPI3_CS1/PA9)
ETXCK: U1.D12(ETXCK/UART7_TX/UART1_DTR/PA14)
ETXD0: U1.E8(ETXD0/SPI3_MOSI/PA7)
ETXD1: U1.D8(ETXD1/SPI3_CLK/PA6)
ETXD2: U1.E7(ETXD2/SPI3_CS0/PA5)
ETXD3: U1.D7(ETXD3/SPI1_CS1/PA4)
ETXEN: U1.E11(ETXEN/UART6_RX/UART1_CTS/PA13)
EXTEN: U12.20(EXTEN) U15.1(EN) U16.4(EN)
FMINL: U1.Y20(FMINL)
FMINR: U1.Y21(FMINR)
GND [PWR]: C2.1 C3.1 C4.1 C5.1 C6.1 C7.1 C8.1 C9.1 C10.1 C11.1 C12.1 C13.1 C14.1 C15.1 C16.1 C18.1 C19.1 C20.1 C21.1 C22.1 C23.1 C24.1 C25.1 C26.1 C27.1 C28.1 C29.1 C30.1 C31.1 C32.1 C33.1 C34.1 C35.1 C36.1 C37.1 C38.1 C39.1 C40.1 C41.1 C42.1 C43.1 C44.1 C45.1 C46.1 C47.1 C48.1 C49.1 C50.1 C51.1 C52.1 C53.1 C54.1 C55.1 C56.1 C57.1 C58.1 C59.1 C60.1 C61.1 C62.1 C68.1 C69.1 C70.1 C71.1 C77.1 C78.1 C79.1 C80.1 C81.1 C82.1 C83.1 C84.1 C85.1 C86.1 C87.1 C88.1 C89.1 C90.1 C91.1 C94.1 C97.1 C98.1 C99.1 C100.1 C101.1 C102.1 C103.1 C104.1 C105.1 C106.1 C107.1 C108.1 C109.1 C117.1 C118.1 C119.1 C120.1 C121.1 C122.2 C123.- C124.2 C125.2 C127.1 C129.1 C131.1 C132.1 C133.1 C134.1 C138.1 C139.1 C145.1 C149.1 C151.2 C152.2 C153.2 C154.2 C155.2 C156.2 C157.1 C158.1 C159.2 C160.2 C162.2 C164.2 C165.2 C166.2 C167.1 C168.1 C169.1 C170.1 C171.1 C172.2 C173.1 C174.1 C175.1 C176.1 C177.1 C178.2 C179.2 C180.2 C181.1 C182.1 C183.1 C184.2 C185.1 C186.1 C187.2 C188.1 C189.2 C190.1 C191.2 C192.1 C193.1 C194.2 C196.1 C198.2 C199.2 C202.- C203.2 C204.2 C205.2 C206.2 C207.2 C209.1 C210.1 C211.2 C212.2 C219.2 C220.2 C221.2 D5.A GND.1(PP) GND_PIN.P$1(PP) JTAG.4 JTAG.6 JTAG.8 JTAG.10 JTAG.12 JTAG.14 JTAG.16 JTAG.18 JTAG.20 L7.1 LCD_CON.2 LCD_CON.4 LED1.C LIPO_BAT.2 PWR.- PWR.-- PWR_BUT.P$1 PWR_LED.C Q2.GND R2.1 R7.1 R8.1 R9.1 R10.1 R11.1 R16.1 R24.1(1.1) R29.2 R43.1(1.1) R44.1 R45.1 R46.1 R58.1 R64.1 R67.1 R73.1 R78.2 R85.2 R86.2 R87.1(1.1) R90.2 R92.2 RECOVERY.P$2 RM14.4.1 RM26.1.1 RM26.3.1 RM26.4.1 SD/MMC1.6(VSS) U1.AA18(GND25_TVIN) U1.G3(GND_DRAM) U1.G4(GND_DRAM) U1.H16(TEST) U1.J5(GND_DRAM) U1.J11(GND) U1.K5(GND_DRAM) U1.K11(GND) U1.K12(GND) U1.K13(GND) U1.K14(ULGND) U1.L10(GND) U1.L11(GND) U1.L12(GND) U1.L13(UGND_T) U1.L14(UGND_C) U1.M9(GND_DLL) U1.M10(GND) U1.M11(GND) U1.M12(GND) U1.M13(GND) U1.M14(GND_SATA) U1.N5(GND_DRAM) U1.N10(GND_DLL) U1.N11(GND) U1.N12(GND) U1.N13(GND_SATA) U1.N14(GND_SATA) U1.P5(GND_DRAM) U1.P10(GND_DLL) U1.P11(GND) U1.P12(GND) U1.P13(GND_HDMI) U1.P14(GND_HDMI) U1.P15(PLLGND) U1.R11(GND) U1.R12(GND) U1.R13(GND_HDMI) U1.T11(GND) U1.T12(GND) U1.U5(GND_DRAM) U1.U19(AGND) U1.V5(GND_DRAM) U1.V19(HPGND) U1.W9(GND_LVDS) U1.W10(GND_LVDS) U1.W11(GND_LVDS) U1.W18(GND33_TVOUT) U1.Y7(GND_DRAM) U1.Y8(GND_DRAM) U1.Y18(GND33_TVIN) U2.A1(VSS) U2.A8(VSS) U2.B1(VSS) U2.B2(VSSQ) U2.B8(VSSQ) U2.C9(VSSQ) U2.D1(VSSQ) U2.D8(VSS) U2.D9(VSSQ) U2.F2(VSS) U2.F8(VSS) U2.J1(VSS) U2.J9(VSS) U2.L1(VSS) U2.L9(VSS) U2.N1(VSS) U2.N9(VSS) U3.A1(VSS) U3.A8(VSS) U3.B1(VSS) U3.B2(VSSQ) U3.B8(VSSQ) U3.C9(VSSQ) U3.D1(VSSQ) U3.D8(VSS) U3.D9(VSSQ) U3.F2(VSS) U3.F8(VSS) U3.J1(VSS) U3.J9(VSS) U3.L1(VSS) U3.L9(VSS) U3.N1(VSS) U3.N9(VSS) U4.A1(VSS) U4.A8(VSS) U4.B1(VSS) U4.B2(VSSQ) U4.B8(VSSQ) U4.C9(VSSQ) U4.D1(VSSQ) U4.D8(VSS) U4.D9(VSSQ) U4.F2(VSS) U4.F8(VSS) U4.J1(VSS) U4.J9(VSS) U4.L1(VSS) U4.L9(VSS) U4.N1(VSS) U4.N9(VSS) U5.A1(VSS) U5.A8(VSS) U5.B1(VSS) U5.B2(VSSQ) U5.B8(VSSQ) U5.C9(VSSQ) U5.D1(VSSQ) U5.D8(VSS) U5.D9(VSSQ) U5.F2(VSS) U5.F8(VSS) U5.J1(VSS) U5.J9(VSS) U5.L1(VSS) U5.L9(VSS) U5.N1(VSS) U5.N9(VSS) U8.13(VSS) U8.36(VSS) U9.2(GND) U12.9(PGND2) U12.16(PGND3) U12.22(AGND) U12.46(PGND1) U12.N1(GND_PAD) U12.N2(GND_PAD) U12.N3(GND_PAD) U12.N4(GND_PAD) U12.N5(GND_PAD) U12.N6(GND_PAD) U12.N7(GND_PAD) U12.N8(GND_PAD) U12.N9(GND_PAD) U12.N10(GND_PAD) U12.N11(GND_PAD) U12.N12(GND_PAD) U12.N13(GND_PAD) U12.N14(GND_PAD) U12.N15(GND_PAD) U12.N16(GND_PAD) U12.N17(GND_PAD) U12.VSS(GND_PAD) U13.2(GND) U14.4(GND) U15.2(GND) U16.2(GND) U$1.GND(GND_ITX) U$1.P$2(GND_ITX) U$1.P$3(GND_ITX) U$1.P$4(GND_ITX) UART0.4 USB_OTG.GND VR1.2(VSS)
GNDA: C111.1 C112.1 C113.1 C114.1 R34.1(1.1) R36.2 R87.2(1.2)
HPCOM: L17.1 RM23.2.2 U1.AA19(HPCOM) U1.AA20(HPCOMFB)
HPOUTL: L16.1 RM23.1.2 U1.Y19(HPOUTL)
HPOUTR: L15.1 RM23.3.2 U1.W19(HPOUTR)
IPSOUT: C145.2 C156.1 C162.1 C166.1 C177.2 C180.1 C194.1 C207.1 C210.2 CHGLED.A IPSOUT.1(PP) L20.1 RESET.P$2 U12.7(VIN2) U12.13(LDO24IN) U12.14(VIN3) U12.21(APS) U12.34(IPSOUT) U12.35(IPSOUT) U12.40(LDO3IN) U12.44(VIN1) U13.4(IN) U15.4(IN) U16.5(IN)
JTAG_TCK0: JTAG.9 RM25.1.1 U1.B10(JTAG_CK0/SPI2_CLK/PB15)
JTAG_TDI0: JTAG.5 RM25.3.1 U1.B9(JTAG_DI0/SPI2_MISO/PB17)
JTAG_TDO0: JTAG.13 RM26.2.2 U1.A9(JTAG_DO0/SPI2_MOSI/PB16)
JTAG_TMS0: JTAG.7 RM25.2.1 U1.A10(JTAG_MS0/SPI2_CS0/PB14)
LCD0_CLK: RM22.4.1 U1.Y9(LCD0_CLK/SMC_VCCEN/PD24)
LCD0_D0: RM16.2.1 U1.AB15(LCD0_D0/LVDS0_VP0/PD0)
LCD0_D1: RM16.1.1 U1.AC15(LCD0_D1/LVDS0_VN0/PD1)
LCD0_D2: RM16.4.1 U1.AB14(LCD0_D2/LVDS0_VP1/PD2)
LCD0_D3: RM16.3.1 U1.AC14(LCD0_D3/LVDS0_VN1/PD3)
LCD0_D4: RM17.2.1 U1.AB13(LCD0_D4/LVDS0_VP2/PD4)
LCD0_D5: RM17.1.1 U1.AC13(LCD0_D5/LVDS0_VN2/PD5)
LCD0_D6: RM17.4.1 U1.AB12(LCD0_D6/LVDS0_VPC/PD6)
LCD0_D7: RM17.3.1 U1.AC12(LCD0_D7/LVDS0_VNC/PD7)
LCD0_D8: RM18.3.2 U1.AB11(LCD0_D8/LVDS0_VP3/PD8)
LCD0_D9: RM18.4.2 U1.AC11(LCD0_D9/LVDS0_VN3/PD9)
LCD0_D10: RM18.1.2 U1.Y15(LCD0_D10/LVDS1_VP0/PD10)
LCD0_D11: RM18.2.2 U1.AA15(LCD0_D11/LVDS1_VN0/PD11)
LCD0_D12: RM19.2.1 U1.Y14(LCD0_D12/LVDS1_VP1/PD12)
LCD0_D13: RM19.1.1 U1.AA14(LCD0_D13/LVDS1_VN1/PD13)
LCD0_D14: RM19.4.1 U1.Y13(LCD0_D14/LVDS1_VP2/PD14)
LCD0_D15: RM19.3.1 U1.AA13(LCD0_D15/LVDS1_VN2/PD15)
LCD0_D16: RM20.2.1 U1.Y12(LCD0_D16/LVDS1_VPC/PD16)
LCD0_D17: RM20.1.1 U1.AA12(LCD0_D17/LVDS1_VNC/PD17)
LCD0_D18: RM20.4.1 U1.Y11(LCD0_D18/LVDS1_VP3/PD18)
LCD0_D19: RM20.3.1 U1.AA11(LCD0_D19/LVDS1_VN3/PD19)
LCD0_D20: RM21.2.1 U1.Y10(LCD0_D20/CSI1_MCLK/PD20)
LCD0_D21: RM21.1.1 U1.AA10(LCD0_D21/SMC_VPPEN/PD21)
LCD0_D22: RM21.4.1 U1.AB10(LCD0_D22/SMC_VPPPP/PD22)
LCD0_D23: RM21.3.1 U1.AC10(LCD0_D23/SMC_DET/PD23)
LCD0_DE: RM22.3.1 U1.AA9(LCD0_DE/SMC_RST/PD25)
LCD0_HSYNC: RM22.2.1 U1.AB9(LCD0_HSYNC/SMC_SLK/PD26)
LCD0_VSYNC: RM22.1.1 U1.AC9(LCD0_VSYNC/SMC_SDA/PD27)
LCD_CLK: LCD_CON.31 RM22.4.2
LCD_D0: LCD_CON.21 RM16.2.2
LCD_D1: LCD_CON.22 RM16.1.2
LCD_D2: LCD_CON.23 RM16.4.2
LCD_D3: LCD_CON.24 RM16.3.2
LCD_D4: LCD_CON.25 RM17.2.2
LCD_D5: LCD_CON.26 RM17.1.2
LCD_D6: LCD_CON.27 RM17.4.2
LCD_D7: LCD_CON.28 RM17.3.2
LCD_D8: LCD_CON.13 RM18.3.1
LCD_D9: LCD_CON.14 RM18.4.1
LCD_D10: LCD_CON.15 RM18.1.1
LCD_D11: LCD_CON.16 RM18.2.1
LCD_D12: LCD_CON.17 RM19.2.2
LCD_D13: LCD_CON.18 RM19.1.2
LCD_D14: LCD_CON.19 RM19.4.2
LCD_D15: LCD_CON.20 RM19.3.2
LCD_D16: LCD_CON.5 RM20.2.2
LCD_D17: LCD_CON.6 RM20.1.2
LCD_D18: LCD_CON.7 RM20.4.2
LCD_D19: LCD_CON.8 RM20.3.2
LCD_D20: LCD_CON.9 RM21.2.2
LCD_D21: LCD_CON.10 RM21.1.2
LCD_D22: LCD_CON.11 RM21.4.2
LCD_D23: LCD_CON.12 RM21.3.2
LCD_DE: LCD_CON.32 RM22.3.2
LCD_HSYNC: LCD_CON.29 RM22.2.2
LCD_PWR: LCD_CON.35 U1.C4(LCD1_D8/ATAD4/KP_IN0/MS_D0/EINT8/CSI1_D8/PH8)
LCD_VSYNC: LCD_CON.30 RM22.1.2
LDO3_2.8V [PWR]: C86.2 C179.1 U1.F19(VCC_CSI0) U12.41(LDO3)
LDO4_2.8V [PWR]: C87.2 C187.1 U1.E18(VCC_CSI1) U12.11(LDO4)
LINEINL: U1.AB20(LINEINL)
LINEINR: U1.AB21(LINEINR)
LRADC0: U1.AB23(LRADC0)
LRADC1: U1.AB22(LRADC1)
MIC1OUTN: U1.AC23(MIC1OUTN)
MIC1OUTP: U1.AC22(MIC1OUTP)
MICIN1: C144.1 U1.AC20(MICIN1)
MICIN2: C161.2 U1.AC21(MICIN2)
MICM: C110.1 C146.1 C147.1 C148.1 MIC1.P-(-) R34.2(1.2)
N$1: C120.2 C121.2 U1.AC19(HPVCC)
N$2: R16.2 U1.AA7(SZQ)
N$3: R7.2 U2.H8(ZQ)
N$4: R65.2 U12.36(CHGLED)
N$5: R9.2 U3.H8(ZQ)
N$8: L18.1 U13.3(LX)
N$10: D1.C R27.2
N$11: RECOVERY.P$1 U1.W8(UBOOT_SEL)
N$16: C161.1 R61.2
N$18: 1.5V_E.1 C195.1 C198.1 C199.1 L18.2 R77.1
N$19: C195.2 R77.2 R78.1 U13.5(FB)
N$22: AUDIO_OUT.5 L17.2
N$23: C206.1 D6.1(C) FET1.3(D) R88.2
N$25: AUDIO_OUT.2 L16.2
N$26: AUDIO_OUT.3 L15.2
N$27: R121.1 SCKE1.P$1(PP)
N$28 [PWR]: C178.1 R69.2(1.2) U12.12(LDO2)
N$31: C202.+ D5.C PWR.+ R79.1 U14.2(IN)
N$34: C171.2 RM23.1.1
N$35: C176.2 RM23.2.1
N$36: C203.1 U14.8(SS)
N$37: R79.2 U14.7(EN)
N$38: PWR_BUT.P$2 R70.1
N$42: C192.2 U1.AA16(VRP_TVIN)
N$43: CHGLED.C R65.1
N$44: C170.2 RM23.3.1
N$46: C200.1 U14.1(BS)
N$50: C200.2 L19.1 U14.3(SW)
N$58: R33.1 SD/MMC1.12(PACK)
N$60: C201.1 U14.6(COMP)
N$61: C201.2 R85.1
N$62: R80.1 R86.1 U14.5(FB)
N$64: L21.1 U15.3(LX)
N$65: 3.3V_E.1 C208.1 C211.1 C212.1 L21.2 R89.1
N$66: C208.2 R89.2 R92.1 U15.5(FB)
N$78: C155.1 C157.2 R60.2 U1.T13(VP_HDMI)
N$79: C153.1 U1.R14(VREGIO2_HDMI)
N$80: C154.1 U1.T14(VREGIO1_HDMI)
N$81: R10.2 U4.H8(ZQ)
N$83: R11.2 U5.H8(ZQ)
N$84: R23.1 R24.2(1.2) U1.T9(EFUSE_VDDQ)
N$85: C105.2 C106.2 R31.1 U1.P16(PLLVP25)
N$86: C97.2 Q2.1 U1.F1(CLK32K_IN)
N$99: R45.2 U9.3(ISET)
N$100: C123.+ L6.2 R42.2 U9.1(OUT)
N$102: C133.2 C134.2 R51.1 U1.L15(UVCC_T) U1.L16(UVCC_C)
N$105: C138.2 C139.2 R53.1 U1.K16(ULVDD)
N$115: C107.2 U1.T16(PLLDV)
N$116: C98.2 Q2.2 U1.F2(CLK32K_OUT)
N$119: R64.2 U1.V21(REXT_SATA)
N$120: R67.2 U12.23(BIAS)
N$121: C108.2 U1.R15(PLLVREG)
N$122: C113.2 C114.2 U1.W21(VRP)
N$123: D6.2(A) L20.2 U16.1(LX)
N$124: C88.2 R21.2 U8.19(#WP)
N$125: R58.2 U12.37(TS)
N$126: R88.1 R90.1 U16.3(FB)
N$127: L12.1 U12.45(LX1)
N$128: C150.1 C151.1 L12.2 R59.1 U12.43(CHSENSE)
N$129: PWR_LED.A R81.2
N$130: L13.1 U12.8(LX2)
N$131: L14.1 U12.15(LX3)
N$132: C174.2 U12.24(VREF)
N$133: C110.2 U1.W20(VRA1)
N$134: C149.2 R62.1
N$135: C158.2 R63.1
N$139: C182.2 R70.2 U12.47(PWRON)
N$140: R73.2 RESET.P$1 U12.4(N_OE)
N$176: C111.2 C112.2 R36.1 U1.V20(VRA2)
N$186: C144.2 C146.2 MIC1.P+(+) R56.1
N$187: C147.2 R56.2 R57.1 R61.1
N$188: JTAG.11 RM26.1.2
N$189: JTAG.17 RM26.3.2
N$190: R43.2(1.2) U1.T10(JTAG_SEL)
N$191: C168.2 C169.2 R66.1 U1.N15(VDD25_SATA) U1.N16(VDD25_SATA)
N$196: C173.2 C175.2 R68.1 U1.M15(VDD12_SATA) U1.M16(VDD12_SATA)
N$197: C13.2 C14.2 C15.2 C16.2 R3.1 U1.M8(VDD_DLL) U1.N9(VDD_DLL) U1.P9(VDD_DLL)
N$220: C191.1 C193.2 R74.2 U1.W16(VCC33_TVIN)
N$221: C189.1 C190.2 R72.2 U1.W15(VCC33_TVOUT)
N$222: C184.1 C186.2 R71.2 U1.W17(VDD25_TVIN)
N$223: C196.2 U1.Y16(VRN_TVIN)
N$229: LCD_CON.33 R49.1
N$230: LCD_CON.34 R50.1
N$231: LED1.A R32.2
N$232: NAND_E.1 R19.2 U8.9(#CE)
N$266: L7.2 USB_OTG.GND1 USB_OTG.GND2 USB_OTG.GND3 USB_OTG.GND4
NMI_N: R27.1 U1.F5(NMI#) U12.48(IRQ/WAKEUP)
ODT0: R15.2 U1.AA5(ODT0)
ODT1: U1.J3(ODT1)
PIN0: U12.19(GPIO0/LDO)
PIN1: U12.18(GPIO1)
PIN2: U12.5(GPIO2)
PIN3: U12.3(GPIO3)
PIN4/TWI0-SCK: R75.1 U1.A15(TWI0_SCK/PB0) U12.2(SCK)
PIN5/TWI0-SDA: R76.1 U1.B15(TWI0_SDA/PB1) U12.1(SDA)
PIN6/PWM0: LCD_CON.36 U1.A14(PWM0/PB2)
PIN7: R49.2 U1.B14(IR0_TX/SPDIF_MCLK/STANBYWFI/PB3)
PIN8: R50.2 U1.A13(IR0_RX/PB4)
PIN9: U1.C11(I2S_DO2/PB10)
PIN12/NWE: U1.M23(NWE#/SPI0_MOSI/PC0) U8.18(#WE)
PIN13/NALE: U1.M22(NALE/SPI0_MISO/PC1) U8.17(ALE)
PIN14/NCLE: U1.L23(NCLE/SPI0_CLK/PC2) U8.16(CLE)
PIN15/NCE1: U1.L22(NCE1/PC3)
PIN16/NCE0: NAND_E.2 U1.K23(NCE0/PC4)
PIN17/NRE: U1.K22(NRE#/PC5) U8.8(#RE)
PIN18/NRB0: R18.2 U1.J23(NRB0/SDC2_CMD/PC6) U8.7(R/#B)
PIN19/NRB1: U1.J22(NRB1/SDC2_CLK/PC7)
PIN20/NDQ0: U1.H23(NDQ0/SDC2_D0/PC8) U8.29(I/O0)
PIN21/NDQ1: U1.H22(NDQ1/SDC2_D1/PC9) U8.30(I/O1)
PIN22/NDQ2: U1.G23(NDQ2/SDC2_D2/PC10) U8.31(I/O2)
PIN23/NDQ3: U1.G22(NDQ3/SDC2_D3/PC11) U8.32(I/O3)
PIN24/NDQ4: U1.H21(NDQ4/PC12) U8.41(I/O4)
PIN25/NDQ5: U1.H20(NDQ5/PC13) U8.42(I/O5)
PIN26/NDQ6: U1.G21(NDQ6/PC14) U8.43(I/O6)
PIN27/NDQ7: U1.G20(NDQ7/PC15) U8.44(I/O7)
PIN28/NDQS: U1.F21(NDQS/PC24)
PIN29: U1.C23(TS0_D0/CSI0_D0/PE4)
PIN30: U1.C22(TS0_D1/CSI0_D1/PE5)
PIN31: U1.B23(TS0_D2/CSI0_D2/PE6)
PIN32: U1.B22(TS0_D3/CSI0_D3/PE7)
PIN33: U1.A23(TS0_D4/CSI0_D4/PE8)
PIN34: U1.A22(TS0_D5/CSI0_D5/PE9)
PIN35: U1.B21(TS0_D6/CSI0_D6/PE10)
PIN36: U1.A21(TS0_D7/CSI0_D7/PE11)
PIN37/LED1 [PWR]: R32.1 U1.D22(TS0_DVLD/CSI0_VSYNC/PE3)
PIN38: U1.D23(TS0_SYNC/CSI0_HSYNC/PE2)
PIN39 [PWR]: U1.E22(TS0_ERR/CSI0_MCLK/PE1)
PIN40: U1.B19(PWM1/PI3)
PIN41: U1.A20(GPS_CLK/PI0)
PIN42: U1.B20(GPS_SIGN/PI1)
PIN43: U1.A19(GPS_MAG/PI2)
PIN44: U1.C17(SPI0_CS0/UART5_TX/EINT22/PI10)
PIN45: U1.D17(SPI0_CLK/UART5_RX/EINT23/PI11)
PIN46: U1.E23(TS0_CLK/CSI0_PCLK/PE0)
PIN47: U1.F20(TS1_CLK/CSI1_PCLK/SDC1_CMD/PG0)
PIN48: U1.E21(TS1_ERR/CSI1_MLCK/SDC1_CLK/PG1)
PIN49: U1.E20(TS1_SYNC/CSI1_HSYNC/SDC1_D0/PG2)
PIN50: U1.D21(TS1_DVLD/CSI1_VSYNC/SDC1_D1/PG3)
PIN51: U1.D20(TS1_D0/CSI1_D0/SDC1_D2/CSI0_D8/PG4)
PIN52: U1.C21(TS1_D1/CSI1_D1/SDC1_D3/CSI0_D9/PG5)
PIN53: U1.E19(TS1_D2/CSI1_D2/UART3_TX/CSI0_D10/PG6)
PIN54: U1.C20(TS1_D3/CSI1_D3/UART3_RX/CSI0_D11/PG7)
PIN55: U1.D19(TS1_D4/CSI1_D4/UART3_RTS/CSI0_D12/PG8)
PIN56: U1.C19(TS1_D5/CSI1_D5/UART3_CTS/CSI0_D13/PG9)
PIN57: U1.D18(TS1_D6/CSI1_D6/UART4_TX/CSI0_D14/PG10)
PIN58: U1.C18(TS1_D7/CSI1_D7/UART4_RX/CSI0_D15/PG11)
PIN59: U1.C15(PS2_SCK1/TCLKIN0/EINT26/SPI0_CS1/PI14)
PIN60: U1.D15(PS2_SDA1/TCLKIN1/EINT27/SPI1_CS1/PI15)
PIN61: U1.F4(LCD1_VSYNC/ATAIOW/KP_OUT7/SDC1_D3/CSI1_VSYNC/PH27)
PIN62: U1.F3(LCD1_HSYNC/ATAIOR/KP_OUT6/SDC1_D2/CSI1_HSYNC/PH26)
PIN63: U1.E4(LCD1_DE/ATAIORDY/KP_OUT5/SDC1_D1/CSI1_FIELD/PH25)
PIN64: U1.E3(LCD1_CLK/ATACS1/KP_OUT4/SDC1_D0/CSI1_PCLK/PH24)
PIN65: U1.E2(LCD1_D23/ATACS0/KP_OUT3/SDC1_CLK/CSI1_D23/PH23)
PIN66: U1.E1(LCD1_D22/ATADACK/KP_OUT2/SDC1_CMD/CSI1_D22/PH22)
PIN67: U1.D3(LCD1_D21/ATADREQ/CAN_RX/EINT21/CSI1_D21/PH21)
PIN68: U1.D2(LCD1_D20/ATAOE/CAN_TX/EINT20/CSI1_D20/PH20)
PIN69: U1.D1(LCD1_D19/ATAD15/KP_OUT1/SMC_SDA/EINT19/CSI1_D19/PH19)
PIN70: U1.C2(LCD1_D18/ATAD14/KP_OUT0/SMC_SLK/EINT18/CSI1_D18/PH18)
PIN71: U1.C1(LCD1_D17/ATAD13/KP_IN7/SMC_VCCEN/EINT17/CSI1_D17/PH17)
PIN72: U1.B1(LCD1_D16/ATAD12/KP_IN6/SMC_DET/EINT16/CSI1_D16/PH16)
PIN73 [PWR]: U1.A1(LCD1_D15/ATAD11/KP_IN5/SMC_VPPPP/EINT15/CSI1_D15/PH15)
PIN74: U1.B2(LCD1_D14/ATAD10/KP_IN4/SMC_VPPEN/EINT14/CSI1_D14/PH14)
PIN75 [PWR]: U1.A2(LCD1_D13/ATAD9/PS2_SDA1/SMC_RST/EINT13/CSI1_D13/PH13)
PIN76: U1.C3(LCD1_D12/ATAD8/PS2_SCK1/EINT12/CSI1_D12/PH12)
PIN77: U1.A3(LCD1_D10/ATAD6/KP_IN2/MS_D2/EINT10/CSI1_D10/PH10)
PIN78: U1.D4(LCD1_D9/ATAD5/KP_IN1/MS_D1/EINT9/CSI1_D9/PH9)
PIN79: U1.B4(LCD1_D7/ATAD3/UART5_RX/MS_CLK/EINT7/CSI1_D7/PH7)
PIN80: U1.C6(LCD1_D2/ATAA2/UART3_RTS/EINT2/CSI1_D2/PH2)
PIN81: U1.A6(LCD1_D0/ATAA0/UART3_TX/EINT0/CSI1_D0/PH0)
PIN82: U1.G19(SPI0_CS0/PC23)
PIN83: U1.F22(NCE3/PC18)
PIN84: U1.F23(NCE2/PC17)
PIN85: U1.M21(NWP/PC16)
PIN86: U1.B11(SPI2_CS1/SPDIF_DO/PB13)
PIN87: U1.C9(I2S_DI/AC97_DI/SPDIF_DI/PB12)
PIN88: U1.C10(I2S_DO3/PB11)
PIN89: U1.A11(I2S_DO0/AC97_DO/PB8)
PIN90: U1.B12(I2S_LRCK/AC97_SYNC/PB7)
PIN91: U1.A12(I2S_BCLK/AC97_BCLK/PB6)
PIN92: U1.B13(I2S_MCLK/AC97_MCLK/PB5)
RASN: U1.T4(SRAS) U2.F3(#RAS) U3.F3(#RAS) U4.F3(#RAS) U5.F3(#RAS)
RESET_N: C91.2 C94.2 JTAG.15 R28.1 U1.C14(RESET#) U12.25(PWROK)
SA0: U1.W4(SA0) U2.K3(A0) U3.K3(A0) U4.K3(A0) U5.K3(A0)
SA1: U1.R4(SA1) U2.L7(A1) U3.L7(A1) U4.L7(A1) U5.L7(A1)
SA2: U1.U4(SA2) U2.L3(A2) U3.L3(A2) U4.L3(A2) U5.L3(A2)
SA3: U1.M4(SA3) U2.K2(A3) U3.K2(A3) U4.K2(A3) U5.K2(A3)
SA4: U1.Y4(SA4) U2.L8(A4) U3.L8(A4) U4.L8(A4) U5.L8(A4)
SA5: U1.N4(SA5) U2.L2(A5) U3.L2(A5) U4.L2(A5) U5.L2(A5)
SA6: U1.V4(SA6) U2.M8(A6) U3.M8(A6) U4.M8(A6) U5.M8(A6)
SA7: U1.M3(SA7) U2.M2(A7) U3.M2(A7) U4.M2(A7) U5.M2(A7)
SA8: U1.AA3(SA8) U2.N8(A8) U3.N8(A8) U4.N8(A8) U5.N8(A8)
SA9: U1.P4(SA9) U2.M3(A9) U3.M3(A9) U4.M3(A9) U5.M3(A9)
SA10: U1.L3(SA10) U2.H7(A10/AP) U3.H7(A10/AP) U4.H7(A10/AP) U5.H7(A10/AP)
SA11: U1.W3(SA11) U2.M7(A11) U3.M7(A11) U4.M7(A11) U5.M7(A11)
SA12: U1.P3(SA12) U2.K7(A12/#BC) U3.K7(A12/#BC) U4.K7(A12/#BC) U5.K7(A12/#BC)
SA13: U1.Y3(SA13) U2.N3(A13) U3.N3(A13) U4.N3(A13) U5.N3(A13)
SA14: U1.R3(SA14) U2.N7(A14) U3.N7(A14) U4.N7(A14) U5.N7(A14)
SCK: R118.2 U1.V1(SCK)
SCK#: R119.2 U1.V2(SCK#)
SCKE0: R120.2 U1.N3(SCKE0)
SCKE1: R121.2 U1.J4(SCKE1)
SCS0: U1.V3(SCS0) U2.H2(#CS) U3.H2(#CS) U4.H2(#CS) U5.H2(#CS)
SCS1: U1.AA4(SCS1)
SD0-CLK: SD/MMC1.5(CLK/SCLK) U1.L20(SDC0_CLK/UART0_TX/PF2)
SD0-CMD: R30.1 SD/MMC1.3(CMD/DI) U1.L19(SDC0_CMD/JTAG_DO1/PF3)
SD0-D0: RM14.2.1 SD/MMC1.7(DAT0/DO) U1.M19(SDC0_D0/JTAG_DI1/PF1)
SD0-D1: RM14.3.1 SD/MMC1.8(DAT1/RES) U1.M20(SDC0_D1/JTAG_MS1/PF0)
SD0-D2: RM14.1.1 SD/MMC1.1(DAT2/RES) U1.K19(SDC0_D2/JTAG_CK1/PF5)
SD0-D3: R29.1 SD/MMC1.2(CD/DAT3/CS) U1.K20(SDC0_D3/UART0_RX/PF4)
SD0-DET#: RM14.4.2 SD/MMC1.10(CP_E) U1.B6(LCD1_D1/ATAA1/UART3_RX/EINT1/CSI1_D1/PH1)
SD3-CLK: U1.B18(SDC3_CLK/PI5)
SD3-CMD: U1.A18(SDC3_CMD/PI4)
SD3-D0: U1.A17(SDC3_D0/PI6)
SD3-D1: U1.B17(SDC3_D1/PI7)
SD3-D2: U1.A16(SDC3_D2/PI8)
SD3-D3: U1.B16(SDC3_D3/PI9)
SD3-DET#: U1.B3(LCD1_D11/ATAD7/KP_IN3/MS_D3/EINT11/CSI1_D11/PH11)
SD_VCC: C103.2 C104.2 L4.2 SD/MMC1.4(VDD)
SDBG0: U1.P8(SDBG0)
SDBG1: U1.R8(SDBG1)
SDQ0: RM1.2.2 U1.AB4(SDQ0)
SDQ1: RM2.2.2 U1.AC7(SDQ1)
SDQ2: RM1.3.2 U1.AC4(SDQ2)
SDQ3: RM2.3.2 U1.AB8(SDQ3)
SDQ4: RM2.4.2 U1.AC8(SDQ4)
SDQ5: RM1.4.2 U1.AB5(SDQ5)
SDQ6: RM2.1.2 U1.AB7(SDQ6)
SDQ7: RM1.1.2 U1.AC3(SDQ7)
SDQ8: RM3.2.2 U1.AB2(SDQ8)
SDQ9: RM4.2.2 U1.Y1(SDQ9)
SDQ10: RM3.3.2 U1.AC2(SDQ10)
SDQ11: RM4.3.2 U1.Y2(SDQ11)
SDQ12: RM4.4.2 U1.AA1(SDQ12)
SDQ13: RM3.4.2 U1.AB3(SDQ13)
SDQ14: RM4.1.2 U1.W2(SDQ14)
SDQ15: RM3.1.2 U1.AC1(SDQ15)
SDQ16: RM5.2.2 U1.N1(SDQ16)
SDQ17: RM6.2.2 U1.T2(SDQ17)
SDQ18: RM5.3.2 U1.N2(SDQ18)
SDQ19: RM6.3.2 U1.U1(SDQ19)
SDQ20: RM6.4.2 U1.U2(SDQ20)
SDQ21: RM5.4.2 U1.P1(SDQ21)
SDQ22: RM6.1.2 U1.T1(SDQ22)
SDQ23: RM5.1.2 U1.M2(SDQ23)
SDQ24: RM7.2.2 U1.L1(SDQ24)
SDQ25: RM8.2.2 U1.H1(SDQ25)
SDQ26: RM7.3.2 U1.L2(SDQ26)
SDQ27: RM8.3.2 U1.H2(SDQ27)
SDQ28: RM8.4.2 U1.J1(SDQ28)
SDQ29: RM7.4.2 U1.M1(SDQ29)
SDQ30: RM8.1.2 U1.G2(SDQ30)
SDQ31: RM7.1.2 U1.K2(SDQ31)
SDQM0: R110.1 U2.B7(DM/TDQS)
SDQM1: R111.1 U3.B7(DM/TDQS)
SDQM2: R112.1 U4.B7(DM/TDQS)
SDQM3: R113.1 U5.B7(DM/TDQS)
SDQS0: R106.1 U2.C3(DQS)
SDQS0_N: R107.1 U2.D3(#DQS)
SDQS1: R108.1 U3.C3(DQS)
SDQS1_N: R109.1 U3.D3(#DQS)
SDQS2: R114.1 U4.C3(DQS)
SDQS2_N: R115.1 U4.D3(#DQS)
SDQS3: R116.1 U5.C3(DQS)
SDQS3_N: R117.1 U5.D3(#DQS)
SPI1-CLK: U1.E16(EINT29/SPI1_CLK/UART2_CTS/PI17)
SPI1-CS0: U1.E17(EINT28/SPI1_CS0/UART2_RTS/PI16)
SPI1-MISO: U1.D14(EINT31/SPI1_MISO/UART2_RX/PI19)
SPI1-MOSI: U1.E15(EINT30/SPI1_MOSI/UART2_TX/PI18)
SPI2-CLK: U1.K21(NCE5/SPI2_CLK/PC20)
SPI2-CS0: U1.L21(NCE4/SPI2_CS0/PC19)
SPI2-MISO: U1.J20(NCE7/SPI2_MISO/PC22)
SPI2-MOSI: U1.J21(NCE6/SPI2_MOSI/PC21)
SRST: R12.2 U1.AA6(SRST)
TPX1: C127.2 LCD_CON.37 U1.Y22(XP_TP)
TPX2: C129.2 LCD_CON.38 U1.AA22(XN_TP)
TPY1: C131.2 LCD_CON.39 U1.Y23(YP_TP)
TPY2: C132.2 LCD_CON.40 U1.AA23(YN_TP)
TRST: JTAG.3 RM25.4.1
TVIN0: C181.2 U1.AC18(TVIN0)
TVIN1: C183.2 U1.AB18(TVIN1)
TVIN2: C185.2 U1.AA17(TVIN2)
TVIN3: C188.2 U1.Y17(TVIN3)
TVOUT3: U1.AB17(TVOUT3)
TWI2-SCK: U1.C8(TWI2_SCK/PB20)
TWI2-SDA: U1.C7(TWI2_SDA/PB21)
UART0-RX: U1.B7(UART0_RX/IR1_RX/PB23) UART0.3
UART0-TX: U1.A7(UART0_TX/IR1_TX/PB22) UART0.2
UART6-RX: U1.D16(SPI0_MISO/UART6_RX/EINT25/PI13)
UART6-TX: U1.C16(SPI0_MOSI/UART6_TX/EINT24/PI12)
UART7-RX: U1.E13(HSDA/UART7_RX/PS2_SDA0/PI21)
UART7-TX: U1.E14(HSCL/UART7_TX/PS2_SCK0/PI20)
UDM0: U1.N20(DM0) USB_OTG.D-
UDM1: U1.P20(DM1)
UDM2: U1.R20(DM2)
UDP0: U1.N21(DP0) USB_OTG.D+
UDP1: U1.P21(DP1)
UDP2: U1.R21(DP2)
USB0-DRV: R44.2 U1.C12(I2S_DO1/PB9) U9.4(EN) U12.6(N_VBUSEN)
USB0-IDDET: R52.2 U1.B5(LCD1_D4/ATAD0/UART4_TX/EINT4/CSI1_D4/PH4) USB_OTG.ID
USB0-VBUSDET: C122.1 R42.1 R46.2 U1.C5(LCD1_D5/ATAD1/UART4_RX/EINT5/CSI1_D5/PH5)
USB1-DRV [PWR]: U1.A4(LCD1_D6/ATAD2/UART5_TX/MS_BS/EINT6/CSI1_D6/PH6)
USB2-DRV [PWR]: U1.A5(LCD1_D3/ATAIRQ/UART3_CTS/EINT3/CSI1_D3/PH3)
V+: 1.5V.1(PP) 1.5V_E.2 C1.1 C2.2 C3.2 C4.2 C5.2 C6.2 C7.2 C8.2 C9.2 C10.2 C11.2 C17.1 C29.2 C30.2 C31.2 C32.2 C33.2 C34.2 C37.2 C38.2 C39.2 C40.2 C41.2 C42.2 C44.2 C45.2 C46.2 C47.2 C48.2 C49.2 C51.2 C52.2 C53.2 C54.2 C55.2 C56.2 R1.2 R4.2 R6.2 U1.G5(VCC_DRAM) U1.H5(VCC_DRAM) U1.L5(VCC_DRAM) U1.M5(VCC_DRAM) U1.R5(VCC_DRAM) U1.T5(VCC_DRAM) U1.W5(VCC_DRAM) U1.W6(VCC_DRAM) U1.W7(VCC_DRAM) U1.Y6(VCC_DRAM) U2.A2(VDD) U2.A9(VDD) U2.B9(VDDQ) U2.C1(VDDQ) U2.D7(VDD) U2.E2(VDDQ) U2.E9(VDDQ) U2.G2(VDD) U2.G8(VDD) U2.K1(VDD) U2.K9(VDD) U2.M1(VDD) U2.M9(VDD) U3.A2(VDD) U3.A9(VDD) U3.B9(VDDQ) U3.C1(VDDQ) U3.D7(VDD) U3.E2(VDDQ) U3.E9(VDDQ) U3.G2(VDD) U3.G8(VDD) U3.K1(VDD) U3.K9(VDD) U3.M1(VDD) U3.M9(VDD) U4.A2(VDD) U4.A9(VDD) U4.B9(VDDQ) U4.C1(VDDQ) U4.D7(VDD) U4.E2(VDDQ) U4.E9(VDDQ) U4.G2(VDD) U4.G8(VDD) U4.K1(VDD) U4.K9(VDD) U4.M1(VDD) U4.M9(VDD) U5.A2(VDD) U5.A9(VDD) U5.B9(VDDQ) U5.C1(VDDQ) U5.D7(VDD) U5.E2(VDDQ) U5.E9(VDDQ) U5.G2(VDD) U5.G8(VDD) U5.K1(VDD) U5.K9(VDD) U5.M1(VDD) U5.M9(VDD) ; supply symbol labelled 1.5V
VCC [PWR]: 3.3V.1(PP) 3.3V_E.2 C68.2 C69.2 C70.2 C77.2 C78.2 C79.2 C80.2 C81.2 C82.2 C83.2 C84.2 C85.2 C89.2 C90.2 C117.2 C118.2 C119.2 C219.1 D1.A JTAG.1 JTAG.2 L4.1 LCD_CON.3 R18.1 R19.1 R21.1 R28.2 R30.2 R31.2 R33.2 R51.2 R52.1 R60.1 R72.1 R74.1 R75.2 R76.2 RM14.1.2 RM14.2.2 RM14.3.2 RM25.1.2 RM25.2.2 RM25.3.2 RM25.4.2 RM26.2.1 U1.AB19(HPVCCIN) U1.H8(VCC) U1.H9(VCC) U1.H10(VCC) U1.H15(VCC) U1.H19(VCC_NAND) U1.J8(VCC) U1.J9(VCC) U1.J10(VCC) U1.J14(VCC) U1.J19(VCC_NAND) U1.N19(VCC_CARD) U1.W12(VCC_LVDS) U1.W13(VCC_LVDS) U1.W14(VCC_LVDS) U8.12(VCC) U8.37(VCC) UART0.1 VR1.1(VIN) VR1.3(CE) ; supply symbol labelled 3.3V
VCC/2: 1.2V_CPU.1(PP) C57.2 C58.2 C59.2 C60.2 C61.2 C62.2 C159.1 C160.1 L13.2 U1.H11(VDD_CPU) U1.H12(VDD_CPU) U1.H13(VDD_CPU) U1.H14(VDD_CPU) U1.J12(VDD_CPU) U1.J13(VDD_CPU) U12.10(DCDC2) ; supply symbol labelled 1.2V_CPU
VCCINT: 1.2V_INT.1(PP) C18.2 C19.2 C20.2 C21.2 C22.2 C23.2 C24.2 C25.2 C26.2 C27.2 C164.1 C165.1 L14.2 R3.2 R53.2 R68.2 U1.J15(VDD_INT) U1.J16(VDD_INT) U1.K9(VDD_INT) U1.K10(VDD_INT) U1.K15(VDD_INT) U1.L8(VDD_INT) U1.L9(VDD_INT) U1.R9(VDD_INT) U1.R10(VDD_INT) U1.T8(VDD_INT) U12.17(DCDC3) ; supply symbol labelled 1.2V_INT
VDD: 2.5V..1(PP) C220.1 C221.1 R23.2 R66.2 R71.1 VR1.5(VOUT) ; supply symbol labelled 2.5V
VDD_RTC: C101.2 C102.2 C172.1 U1.K8(RTC_VDD) U12.28(LDO1)
VINT: C167.2 U12.26(VINT) U12.27(LDO1SET)
VMIC: C148.2 R57.2 U1.AA21(VMIC)
VPP [PWR]: 3.0VA.1(PP) C109.2 R69.1(1.1) U1.T19(AVCC) U13.1(EN) ; supply symbol labelled 3.0VA
WEN: U1.T3(SWE) U2.H3(#WE) U3.H3(#WE) U4.H3(#WE) U5.H3(#WE)
XTALI: C99.2 Q3.2 U1.N23(CLK24M_IN)
XTALO: C100.2 Q3.1 U1.N22(CLK24M_OUT)
Unconnected: AUDIO_OUT.1 AUDIO_OUT.4 RM23.4.1 RM23.4.2 U1.A8(TWI1_SCK/PB18) U1.AB16(TVOUT1) U1.AC16(TVOUT0) U1.AC17(TVOUT2) U1.B8(TWI1_SDA/PB19) U1.P22(HPD_HDMI) U1.P23(CEC_HDMI) U1.R16(PLLREGIO) U1.R22(SDA_HDMI) U1.R23(SCL_HDMI) U1.T15(PLLTEST) U1.T20(TXP_SATA) U1.T21(TXM_SATA) U1.T22(TX2N_HDMI) U1.T23(TX2P_HDMI) U1.U20(RXM_SATA) U1.U21(RXP_SATA) U1.U22(TX1N_HDMI) U1.U23(TX1P_HDMI) U1.V22(TX0N_HDMI) U1.V23(TX0P_HDMI) U1.W22(TXCN_HDMI) U1.W23(TXCP_HDMI) U2.A3(NC) U2.A7(NF/#TDQS) U2.F1(NC) U2.F9(NC) U2.H1(NC) U2.H9(NC) U2.J7(NC) U3.A3(NC) U3.A7(NF/#TDQS) U3.F1(NC) U3.F9(NC) U3.H1(NC) U3.H9(NC) U3.J7(NC) U4.A3(NC) U4.A7(NF/#TDQS) U4.F1(NC) U4.F9(NC) U4.H1(NC) U4.H9(NC) U4.J7(NC) U5.A3(NC) U5.A7(NF/#TDQS) U5.F1(NC) U5.F9(NC) U5.H1(NC) U5.H9(NC) U5.J7(NC) U8.1(NC) U8.2(NC) U8.3(NC) U8.4(NC) U8.5(NC) U8.6(NC) U8.10(NC) U8.11(NC) U8.14(NC) U8.15(NC) U8.20(NC) U8.21(NC) U8.22(NC) U8.23(NC) U8.24(NC) U8.25(NC) U8.26(NC) U8.27(NC) U8.28(NC) U8.33(NC) U8.34(NC) U8.35(NC) U8.38(NC) U8.39(NC) U8.40(NC) U8.45(NC) U8.46(NC) U8.47(NC) U8.48(NC) U12.29(DC3SET) U12.30(BACKUP) U16.6(NC)

## Buses
SA[0..14]
DQ[0..31]
BA[0..2],CLK,CLKN,CKE,CASN,RASN,WEN,SDQM[0..3],SDQS[0..3],SDQS0_N,SDQS1_N,SDQS2_N,SDQS3_N,DDR3_RST,DDR3_ODT,SCS0
LCD_D[0..7],LCD_D[8..15],LCD_D[16..23],LCD_HSYNC,LCD_VSYNC,LCD_CLK,LCD_DE
NDQ[0..7],NWE,NALE,NCLE,NCE0,NCE1,NRE,NRB[0..1],NDQS
JTAG_TDO0,JTAG_TDI0,JTAG_TMS0,JTAG_TCK0
UART0-TX,UART0-RX
ETXD[0..3],ETXEN,ETXCK,ERXD[0..3],ERXDV,ERXCK,ERXERR,EMDC,EMDIO,ECOL,ECRS,EPHY-RST#
VMIC,MICIN1,MICM,MICIN2,HPOUTL,HPCOM,HPOUTR,LINEINR,LINEINL

## Notes on the sheet
- 2 x [2Gb DDR3 SDRAM (256Mx8)]
- NAND Disable Option-> Added!!!!
- NAND Flash
- 32Gb (4096M x 8bit)
- LED | MicroSD
- NC
- NC
- USB-OTG
- LCD EXTENSION | GPIO EXTENSION
- 5.0V | GND
- 3.3V | GND
- Iset = 6800/Rs | Rs
- R0 | R1
- R2 | R3
- R4 | R5
- Iset = 523mA
- R6 | R7
- G0 | G1
- G2 | G3
- G4 | G5
- G6 | G7
- USB-HOSTs
- B0 | B1
- B2 | B3
- B4 | B5
- B6 | B7
- HSYNC | VSYNC
- CLK | DE
- L/R | U/D
- PWRE | BKL
- X1 | X2
- Y1 | Y2
- Audio In/Out & Mic | POWER SUPPLY CIRCUIT
- 1V2/1.6A
- 1V2/1.2A
- 3V3/30mA
- 3V/200mA
- 2V8/200mA
- 2V8/200mA
- Must be Floating!!!
- 6-16VDC
- JTAG | Ra
- Rb
- Vout=0.923x(1+Ra/Rb)
- +
- Rc
- -
- Re
- LI-ION_BATTERY
- Rd
- Rf
- Vout=0.6x(1+Rc/Rd)
- Vout=0.6x(1+Re/Rf)

## Library data of the parts
1.2V_CPU 1.2V_INT 1.5V 2.5V. 3.0VA 3.3V 5VEXT +5V BAT GND GND_PIN IPSOUT SCKE1 = gogo:TESTPAD: drill 40mils, diameter 70mils
1.5V_E 3.3V_E 5V_E = jumper:SJ: SMD solder JUMPER
AUDIO_OUT = gogo:AUDIO_JACK_5PIN
C1-C62 C68-C71 C77-C91 C94 C97-C114 C117-C122 C124 C125 C127 C129 C131-C134 C138 C139 C144-C162 C164-C196 C198-C201 C203-C212 C219-C221 = rcl:C-EU: CAPACITOR, European symbol
C123 C202 = rcl:CPOL-EU: POLARIZED CAPACITOR, European symbol
CHGLED LED1 PWR_LED = DOUBLE-SIDE:LED
D1 D4 = gogo:SCHOTKKY7.62SS
D5 = OLIMEX_DISCRET:SMBJ16A
D6 = semicon-smd-ipc:D-: DIODE unfilled
FET1 = Penko:P-MOS+DIOD
JTAG = con-harting-ml:ML20: HARTING
L4 L6 L7 L15-L17 = rcl:L-US: INDUCTOR, American symbol
L12-L14 L18-L21 = OLIMEX_DISCRET:L
LCD_CON = con-harting-ml:ML40: HARTING
LIPO_BAT = Penko:CON2
MIC1 = DOUBLE-SIDE:MIC: ELECTRETE MICROPHONE
NAND_E = jumper:JP1E: JUMPER
PWR = gogo:PWR-JAK
PWR_BUT RECOVERY RESET = gogo:SW-TAKT
Q2 = crystal:Q_GND
Q3 = crystal:HC49/S: CRYSTAL
R1-R12 R15 R16 R18 R19 R21 R23 R27-R33 R36 R42 R44-R46 R49-R53 R56-R68 R70-R81 R85 R86 R88-R90 R92 R106-R121 = rcl:R-EU_: RESISTOR, European symbol
R24 R34 R43 R69 R87 = OLIMEX_DISCRET:R_0R
RM1-RM8 RM14 RM16-RM23 RM25 RM26 = OLIMEX_DISCRET:R_MATRIX_4E
SD/MMC1 = OLIMEX_CONNECTORS:MICRO_SD/MMC_CP
U1 = OLIMEX_IC:A10
U2-U5 = OLIMEX_IC:H5TQ2G83CFR-H9C
U8 = OLIMEX_IC:H27UBG8T2A
U9 = OLIMEX_IC:SY6280
U12 = OLIMEX_IC:AXP209
U13 U15 = OLIMEX_IC:SY8008
U14 = OLIMEX_IC:MP1482
U16 = OLIMEX_IC:SY7208
U19-U21 = SparkFunEagle-6-6-07:FIDUCIAL: Fiducial Alignment Points Various fiducial points for machine vision alignment.
U$1 = OLIMEX_CASES:NANO_ITX
UART0 = Penko:CON4
USB_OTG = OLIMEX_CONNECTORS:MINI_USB9
VR1 = OLIMEX_DISCRET:AP1231

## Net classes
1 PWR: width 0.127 mm, drill 0.254 mm, clearance 0.076 mm